# EasyEDA Pro project ProProject_2024智能车 驱动板_2024-10-06.epro

# Schematic Schematic1

## Sheets
1 Power: Create Date: 2024-02-26; Page Name: Power; Project Name: 2024智能车 驱动板; Schematic Name: Schematic1; Update Date: 2024-06-05; Company: 嘉立创EDA; Page Size: A4; Version: V1.0
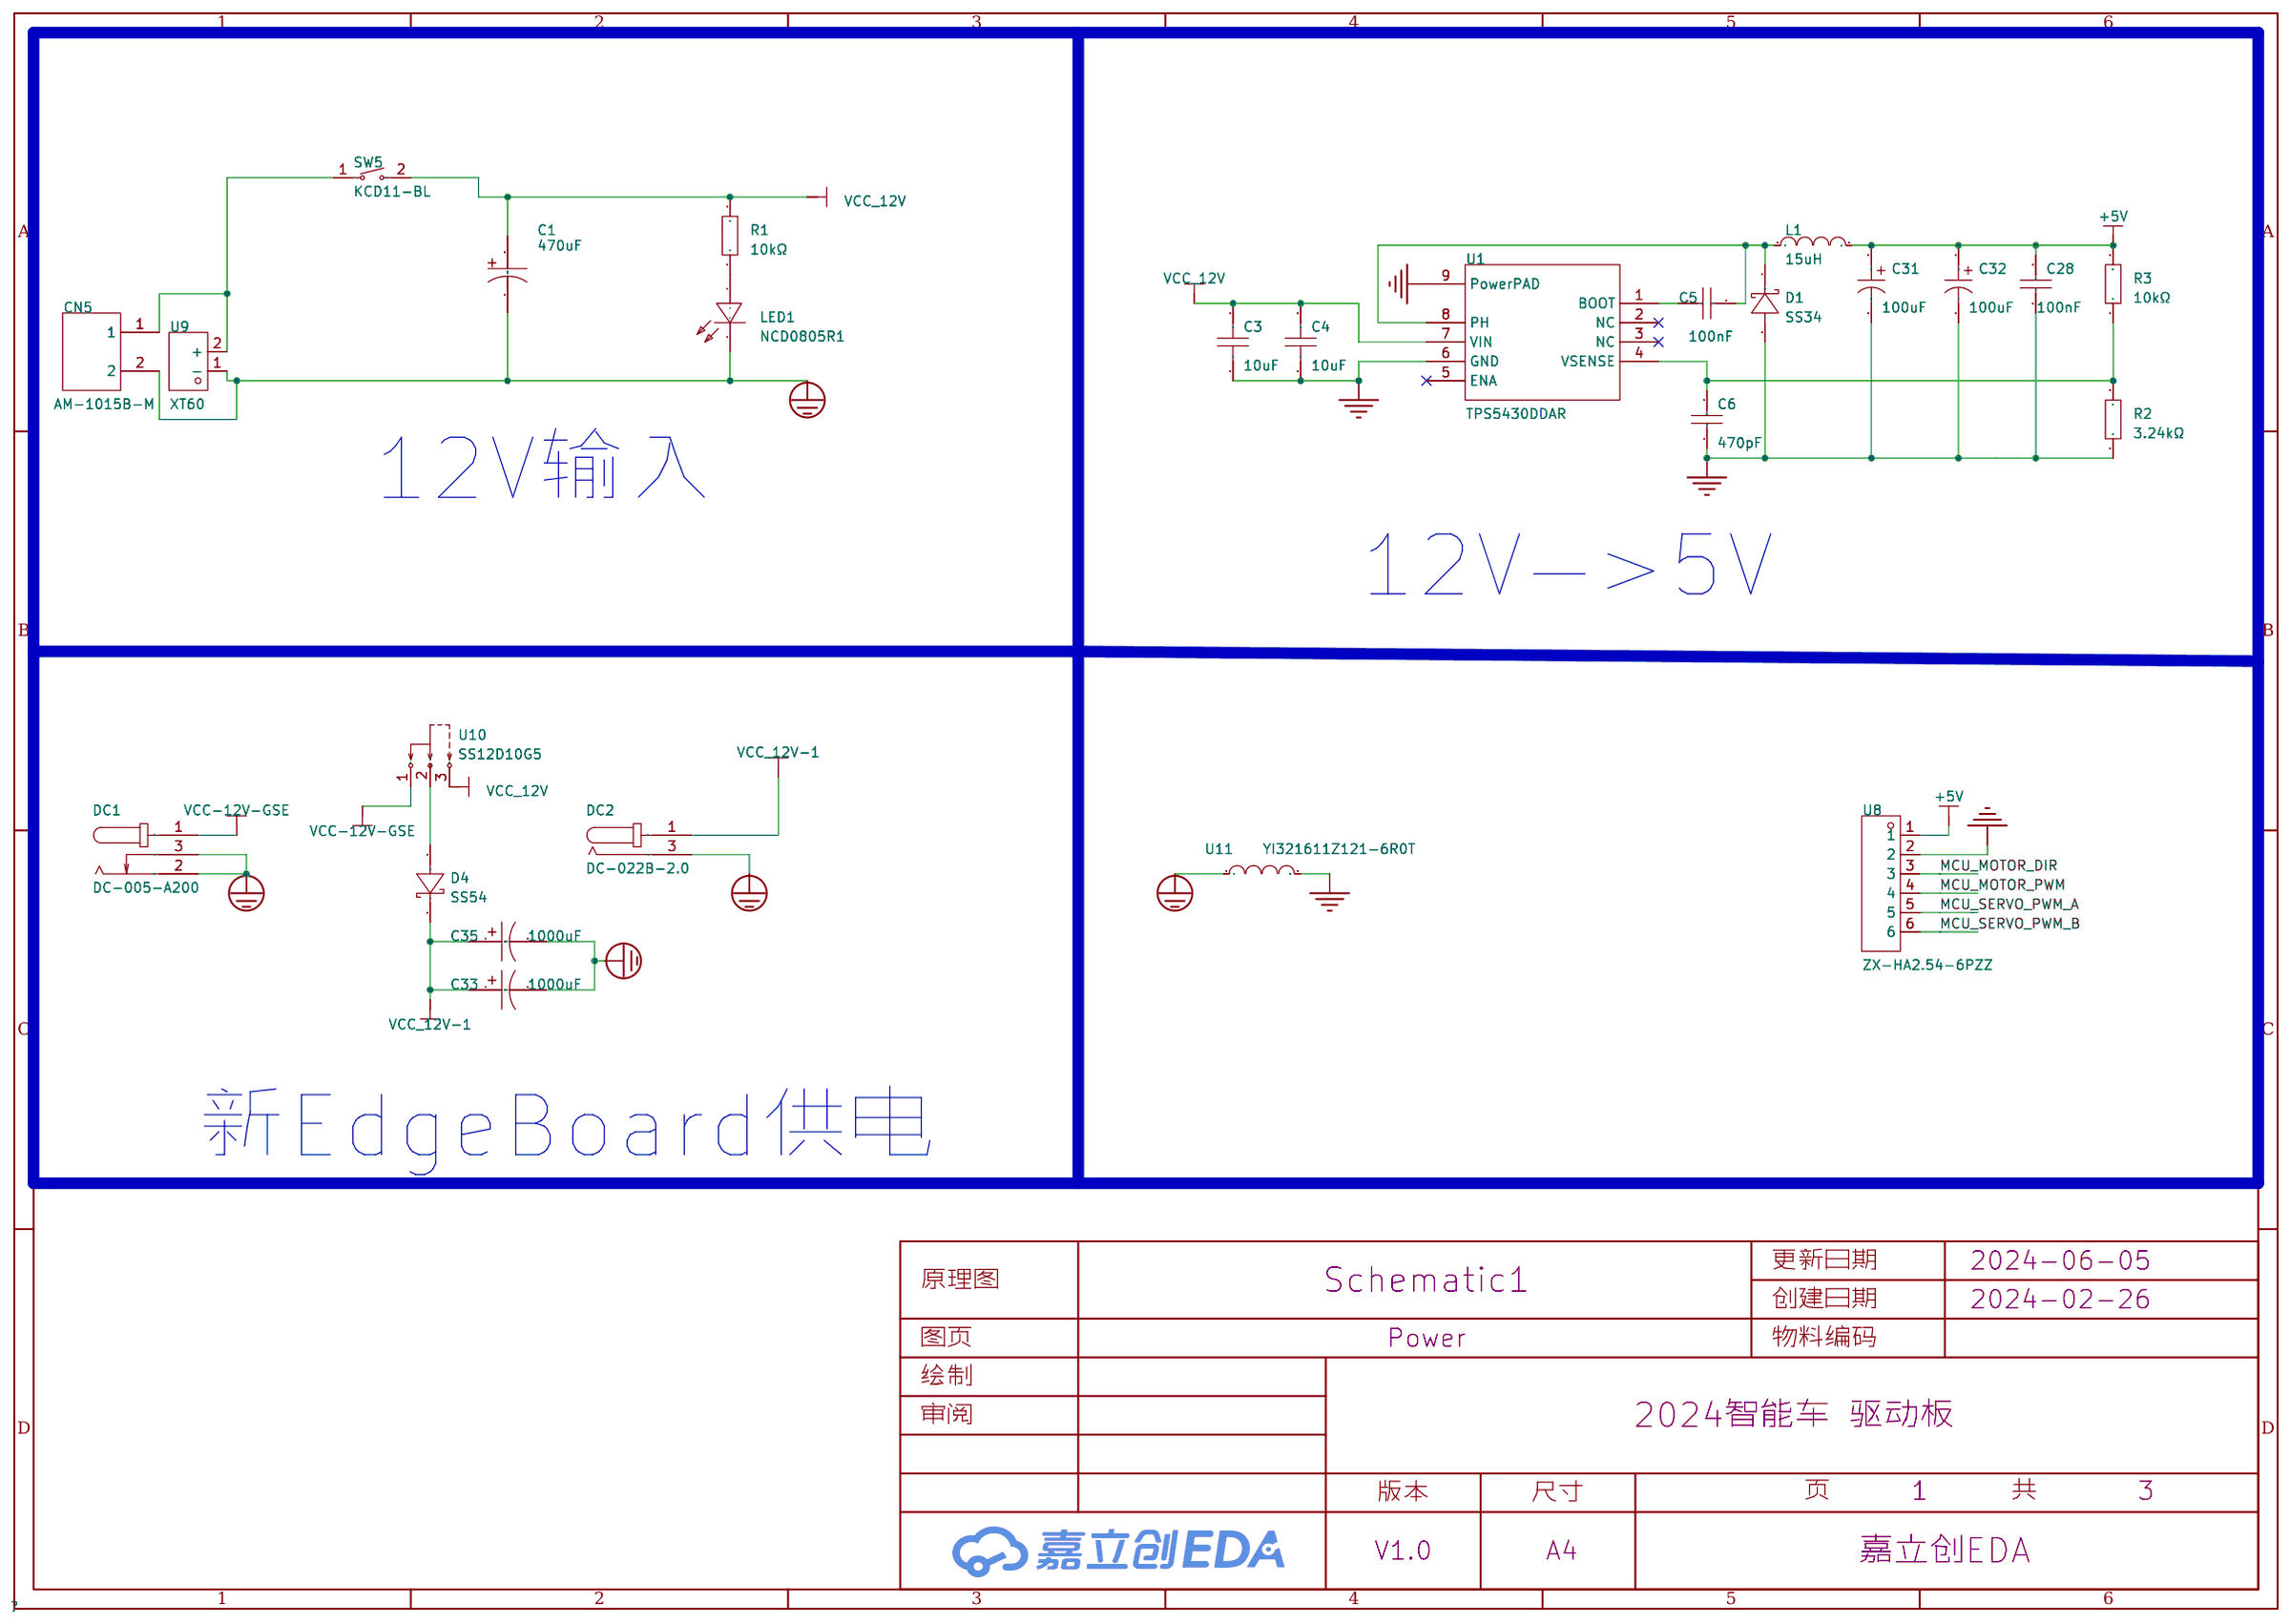
[diagram p0: Power]
2 Servo: Create Date: 2024-03-03; Page Name: Servo
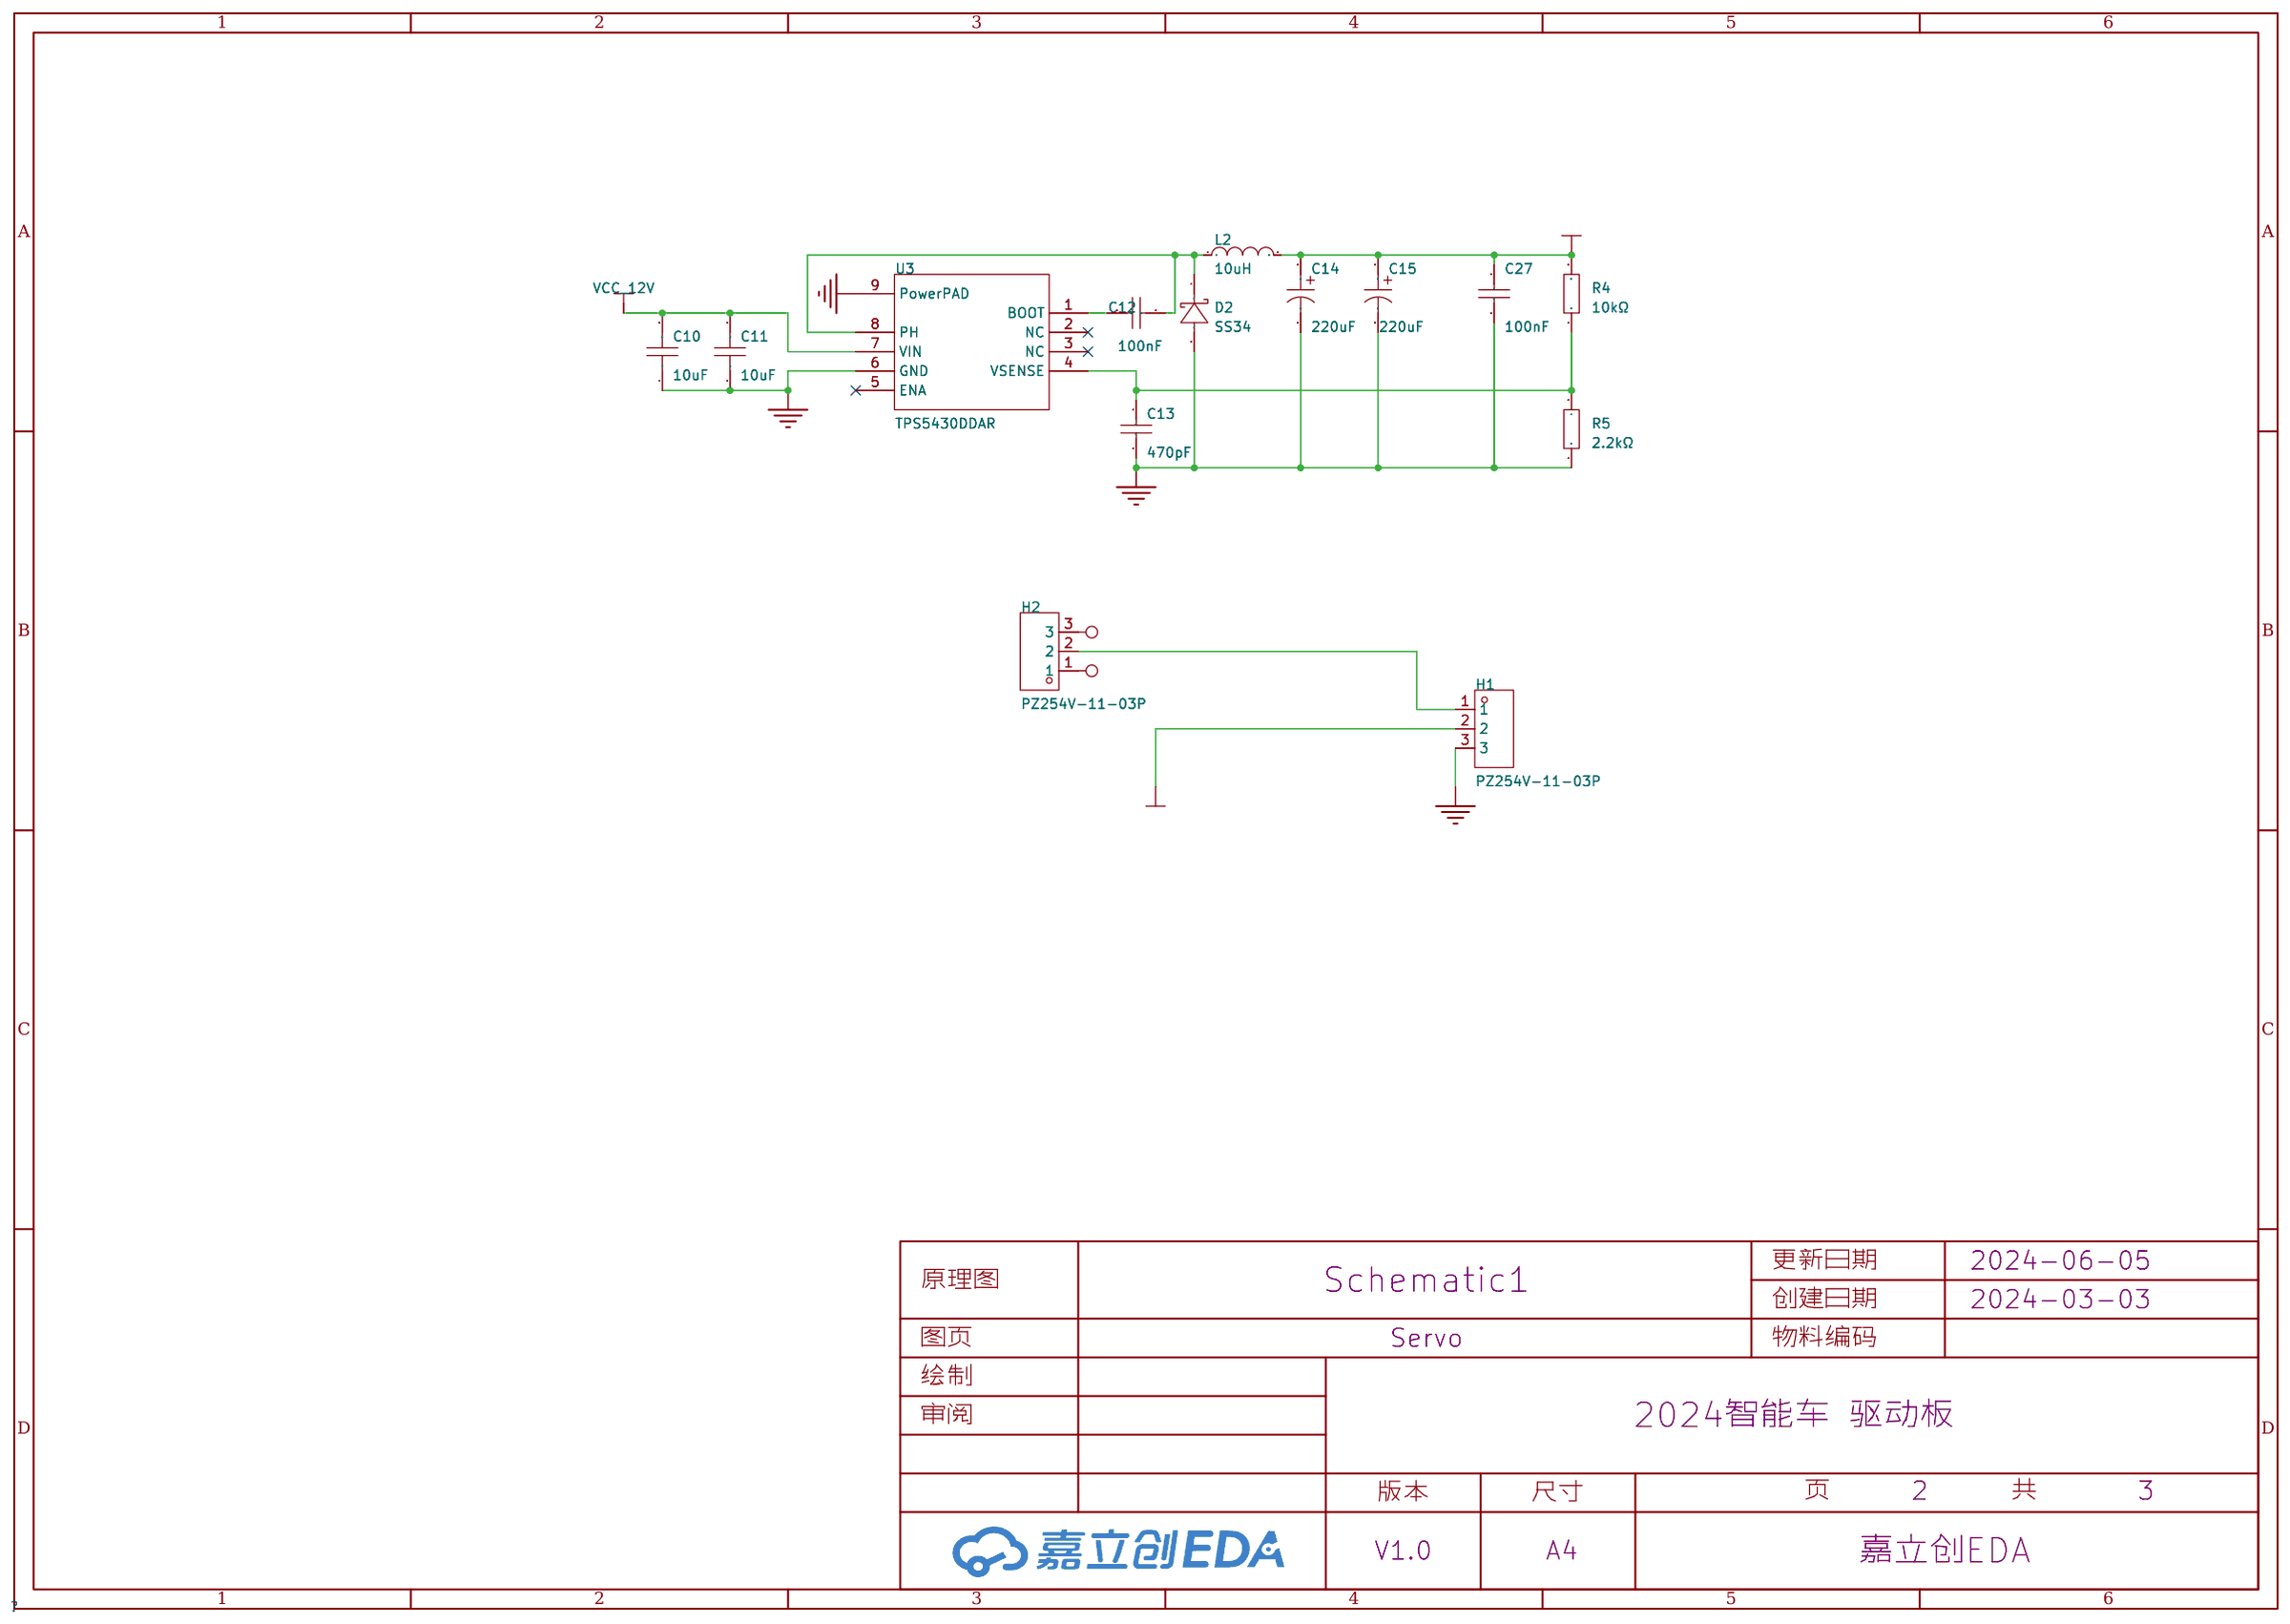
[diagram p1: Servo]
3 Motor DRV: Create Date: 2024-03-03; Page Name: Motor DRV
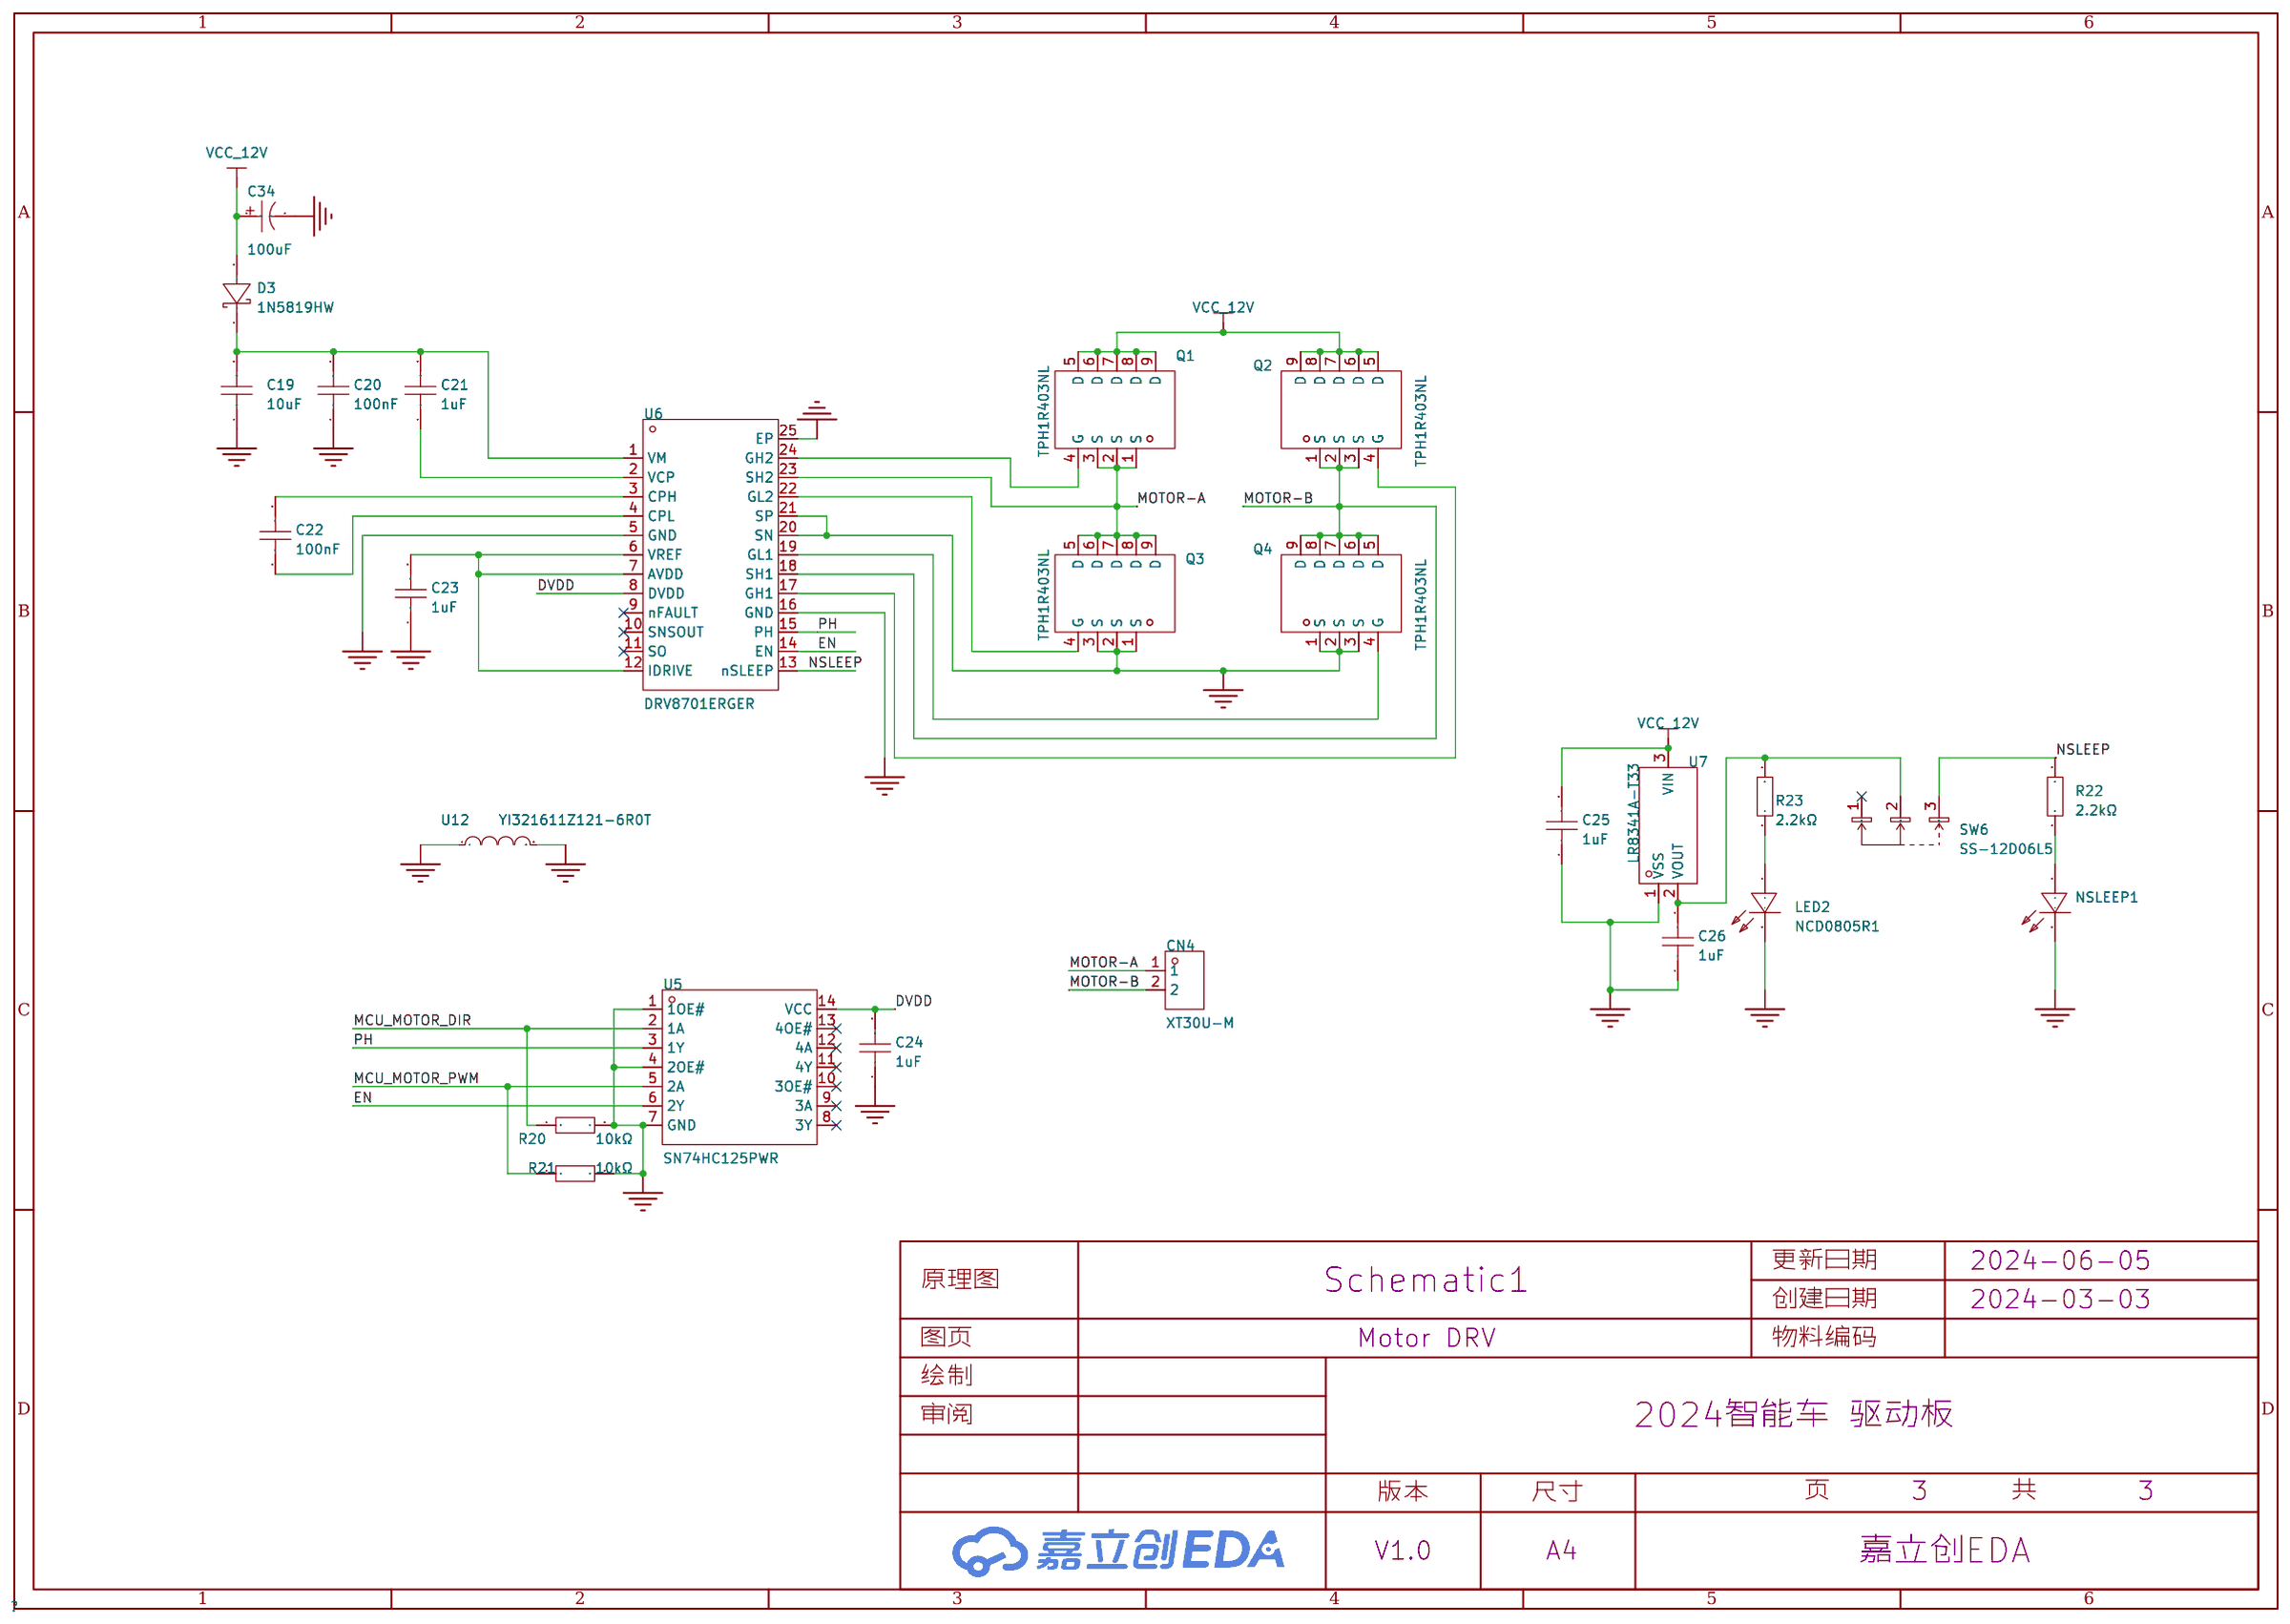
[diagram p2: Motor DRV]

## Parts
sheet Motor DRV
C19  10uF  [C0805]
C20  100nF  [C0603]
C21  1uF  [C0603]
C22  100nF  [C0603]
C23  1uF  [C0603]
C24  1uF  [C0603]
C25  1uF  [C0603]
C26  1uF  [C0603]
C34  100uF  [CAP-TH_BD6.3-P2.50-D1.0-FD]
CN4  XT30U-M  [CONN-TH_XT30U-M]
D3  1N5819HW  [SOD-123_L2.7-W1.6-LS3.7-RD-1]
LED2  NCD0805R1  [LED0805-R-RD]
NSLEEP1  NCD0805R1  [LED0805-R-RD]
Q1  TPH1R403NL  [DSOP-8_L5.0-W5.0-P1.27-LS6.0-BL-EP]
Q2  TPH1R403NL  [DSOP-8_L5.0-W5.0-P1.27-LS6.0-BL-EP]
Q3  TPH1R403NL  [DSOP-8_L5.0-W5.0-P1.27-LS6.0-BL-EP]
Q4  TPH1R403NL  [DSOP-8_L5.0-W5.0-P1.27-LS6.0-BL-EP]
R20  10kΩ  [R0603]
R21  10kΩ  [R0603]
R22  2.2kΩ  [R0603]
R23  2.2kΩ  [R0603]
SW6  SS-12D06L5  [SW-TH_3P-P4.70_L11.1-W12.7]
U5  SN74HC125PWR  [TSSOP-14_L5.0-W4.4-P0.65-LS6.5-BL]
U6  DRV8701ERGER  [VQFN-24_L4.0-W4.0-P0.50-BL-EP2.5]
U7  LR8341A-T33  [SOT-23-3L_L2.9-W1.6-P1.90-LS2.8-BL]
U12  YI321611Z121-6R0T  [L1206]
sheet Power
C1  470uF  [CAP-TH_BD8.0-P3.50-D0.6-FD]
C3  10uF  [C0805]
C4  10uF  [C0805]
C5  100nF  [C0603]
C6  470pF  [C0603]
C28  100nF  [C0603]
C31  100uF  [CAP-SMD_BD6.3-L6.6-W6.6-LS7.2-FD]
C32  100uF  [CAP-SMD_BD6.3-L6.6-W6.6-LS7.2-FD]
C33  1000uF  [CAP-TH_BD13.0-P5.00-D0.6-FD]
C35  1000uF  [CAP-TH_BD13.0-P5.00-D0.6-FD]
CN5  AM-1015B-M  [CONN-TH_AM-1015B-M]
D1  SS34  [SMA_L4.3-W2.5-LS5.0-RD]
D4  SS54  [SMA_L4.3-W2.6-LS5.0-RD]
DC1  DC-005-A200  [DC-IN-TH_DC-005-A200]
DC2  DC-022B-2.0  [DC-IN-TH_DC-022B-2.0]
L1  15uH  [IND-SMD_L7.0-W6.6_FXL0630]
LED1  NCD0805R1  [LED0805-R-RD]
R1  10kΩ  [R0805]
R2  3.24kΩ  [R0603]
R3  10kΩ  [R0603]
SW5  KCD11-BL  [SW-TH_KCD11-BL]
U1  TPS5430DDAR  [ESOP-8_L4.9-W3.9-P1.27-LS6.0-TL-EP]
U8  ZX-HA2.54-6PZZ  [CONN-TH_6P-P2.50_ZX-HA2.54-6PZZ]
U9  XT60  [CONN-TH_XT60]
U10  SS12D10G5  [SW-TH_SHOU-HAN_SS12D10G4]
U11  YI321611Z121-6R0T  [L1206]
sheet Servo
C10  10uF  [C0805]
C11  10uF  [C0805]
C12  100nF  [C0603]
C13  470pF  [C0603]
C14  220uF  [CAP-SMD_BD6.3-L6.6-W6.6-FD]
C15  220uF  [CAP-SMD_BD6.3-L6.6-W6.6-FD]
C27  100nF  [C0603]
D2  SS34  [SMA_L4.3-W2.5-LS5.0-RD]
H1  PZ254V-11-03P  [HDR-TH_3P-P2.54-V-M]
H2  PZ254V-11-03P  [HDR-TH_3P-P2.54-V-M]
L2  10uH  [IND-SMD_L7.0-W6.6_FXL0650]
R4  10kΩ  [R0603]
R5  2.2kΩ  [R0603]
U3  TPS5430DDAR  [ESOP-8_L4.9-W3.9-P1.27-LS6.0-TL-EP]

## Library data of the parts
C19 = GCM21BR7YA105KA55L: 容值:1uF;精度:±10%;额定电压:35V;材质(温度系数):X7R;; LCSC Part Name: 1uF ±10% 35V; Supplier Part: C161268; Manufacturer: muRata(村田); Supplier Footprint: 0805; JLCPCB Part Class: Extended Part; Datasheet: https://atta.szlcsc.com/upload/public/pdf/source/20180821/C161268_D058CC9A7C4743C3F9DA2C30E4C6C8F3.pdf; Supplier: LCSC; Tolerance: ±10%; Voltage Rated: 35V; Temperature Coefficient: X7R
C20 C22 = CC0603KRX7R9BB104: 容值:100nF;精度:±10%;额定电压:50V;材质(温度系数):X7R;; LCSC Part Name: 100nF ±10% 50V; Supplier Part: C14663; Manufacturer: YAGEO(国巨); Supplier Footprint: 0603; JLCPCB Part Class: Basic Part; Datasheet: https://atta.szlcsc.com/upload/public/pdf/source/20180910/C282072_33301C7F631E79921B82A8DAC6BCC5B3.pdf; Supplier: LCSC; Tolerance: ±10%; Voltage Rated: 50V; Temperature Coefficient: X7R
C21 C23 C25 C26 = CAP_0603: Supplier Footprint: 0603
C24 = CL10A105KB8NNNC: 容值:1uF;精度:±10%;额定电压:50V;材质(温度系数):X5R;; LCSC Part Name: 1uF ±10% 50V; Supplier Part: C15849; Manufacturer: SAMSUNG(三星); Supplier Footprint: 0603; JLCPCB Part Class: Basic Part; Datasheet: https://atta.szlcsc.com/upload/public/pdf/source/20160103/1457707679084.pdf; Supplier: LCSC; Tolerance: ±10%; Voltage Rated: 50V; Temperature Coefficient: X5R
C34 = 35ZLH100MEFC6.3X11: 容值:100uF;精度:±20%;额定电压:35V;纹波电流:270mA@120Hz;; LCSC Part Name: 100uF ±20% 35V; Supplier Part: C109392; Manufacturer: rubycon(红宝石); Supplier Footprint: 插件,D6.3xL11mm; JLCPCB Part Class: 扩展库; Datasheet: https://atta.szlcsc.com/upload/public/pdf/source/20180614/C225674_EFD3D7F922578D09CC26AE3D92425FB6.pdf; Supplier: LCSC; Tolerance: ±20%; Rated Voltage: 35V; Ripple Current: 270mA@120Hz; Lead Spacing: 2.5mm; φD: 6.3mm; L: 11mm; Lifetime @ Temp: 6000hrs@105℃; Operating Temperature: -40℃~+105℃
CN4 = XT30U-M: 类别:-;类型1:-;; LCSC Part Name: AMASS(艾迈斯)轻量版锂电池插头公头 XT30U-M; Supplier Part: C99101; Manufacturer: AMASS(艾迈斯); JLCPCB Part Class: 扩展库; Datasheet: https://atta.szlcsc.com/upload/public/pdf/source/20170606/1496716542582.pdf; Supplier: LCSC; Brand: 艾迈斯; Type: 插头; Colour: 黄色; InterfaceType: 公头
D3 = 1N5819HW: 二极管配置:-;直流反向耐压(Vr):40V;平均整流电流(Io):1A;正向压降(Vf):900mV@3A;反向电流(Ir):1mA@40V;; LCSC Part Name: 40V 1A 900mV@3A; Supplier Part: C2905649; Manufacturer: TECH PUBLIC(台舟); Supplier Footprint: SOD-123; JLCPCB Part Class: 扩展库; Datasheet: https://atta.szlcsc.com/upload/public/pdf/source/20211020/8C6B6169F42B21129AF0D528B0E96B00.pdf; Supplier: LCSC; Reverse Voltage (Vr): 40V; Average Rectified Current (Io): 1A; Forward Voltage (Vf@If): 900mV@3A; Reverse Leakage Current (Ir): 1mA@40V
LED1 LED2 = NCD0805R1: 灯头类型:-;发光颜色:红色;正向电压(VF):1.6V~2.6V;功率:65mW;正向电流:20mA;主波长:615nm~630nm;二极管配置:独立二极管;透镜颜色:无色透明透镜;色温:-;发光强度:67mcd~195mcd;发光角度:130°;载带方式:-;工作温度:-30℃~+85℃;; Supplier Part: C84256; Manufacturer: 国星光电; Supplier Footprint: 0805; JLCPCB Part Class: Basic Part; Datasheet: https://atta.szlcsc.com/upload/public/pdf/source/20200820/C84256_F0A75A43B3EAD75808600A0514C76B99.pdf; Supplier: LCSC; Emitted Color: 红色; Forward Voltage (VF): 1.6V~2.6V; Power Dissipation: 65mW; Forward Current: 20mA; Dominant Wavelength: 615nm~630nm; Diode Configuration: 独立二极管; Lens Color: 无色透明透镜; Luminous Intensity: 67mcd~195mcd; Viewing Angle: 130°; Operating Temperature: -30℃~+85℃
NSLEEP1 = NCD0805R1: 发光颜色:红灯;; LCSC Part Name: 红灯; Supplier Part: C84256; Manufacturer: 国星光电; Supplier Footprint: 0805; JLCPCB Part Class: 基础库; Datasheet: https://atta.szlcsc.com/upload/public/pdf/source/20200820/C84256_F0A75A43B3EAD75808600A0514C76B99.pdf; Supplier: LCSC; Emitted Color: 红灯; Forward Voltage (VF): 1.6V~2.6V; Power Dissipation: 65mW; Forward Current: 20mA; Dominant Wavelength: 615nm~630nm; Diode Configuration: 独立二极管; Lens Color: 无色透明透镜; Luminous Intensity: 67mcd~195mcd; Viewing Angle: 130°; Operating Temperature: -30℃~+85℃
Q1-Q4 = TPH1R403NL_C83440: 类型:N沟道;漏源电压(Vdss):30V;连续漏极电流(Id):150A;功率(Pd):64W;导通电阻(RDS(on)@Vgs,Id):1.4mΩ@10V,30A;阈值电压(Vgs(th)@Id):2.3V@500uA;; LCSC Part Name: N沟道 30V 150A; Supplier Part: C83440; Manufacturer: TOSHIBA(东芝); Supplier Footprint: DSOP-8-EP-5.0mm; JLCPCB Part Class: 扩展库; Datasheet: https://atta.szlcsc.com/upload/public/pdf/source/20170908/C83440_1504870121708958077.pdf; Supplier: LCSC; Type: N沟道; Drain Source Voltage (Vdss): 30V; Continuous Drain Current (Id): 150A; Power Dissipation (Pd): 64W; Drain Source On Resistance (RDS(on)@Vgs,Id): 1.4mΩ@10V,30A; Gate Threshold Voltage (Vgs(th)@Id): 2.3V@500uA
R20 R21 = 0603WAF1002T5E: 电阻类型:厚膜电阻;阻值:10kΩ;精度:±1%;功率:100mW;; LCSC Part Name: 厚膜电阻 10kΩ ±1% 100mW; Supplier Part: C25804; Manufacturer: UNI-ROYAL(厚声); Supplier Footprint: 0603; JLCPCB Part Class: Basic Part; Datasheet: https://atta.szlcsc.com/upload/public/pdf/source/20200306/C422600_1E6D84923E4A46A82E41ADD87F860B5C.pdf; Supplier: LCSC; Type: 厚膜电阻; Tolerance: ±1%; Power(Watts): 100mW; Overload Voltage (Max): 75V; Temperature Coefficient: ±100ppm/℃; Operating Temperature Range: -55℃~+155℃
R5 R22 R23 = 0603WAF2201T5E: 电阻类型:厚膜电阻;阻值:2.2kΩ;精度:±1%;功率:100mW;; LCSC Part Name: 2.2kΩ ±1% 100mW; Supplier Part: C4190; Manufacturer: UNI-ROYAL(厚声); Supplier Footprint: 0603; JLCPCB Part Class: Basic Part; Datasheet: https://atta.szlcsc.com/upload/public/pdf/source/20200306/C422600_1E6D84923E4A46A82E41ADD87F860B5C.pdf; Supplier: LCSC; Type: 厚膜电阻; Tolerance: ±1%; Power(Watts): 100mW; Temperature Coefficient: ±100ppm/℃; Overload Voltage (Max): 75V; Operating Temperature Range: -55℃~+155℃
SW6 = SS-12D06L5: 电路结构:单刀双掷;安装方式:侧插;开关颜色:黑色;额定电流(DC):3A;额定电压(DC):250V;额定电流(AC):3A;额定电压(AC):250V;机械寿命:1万次;; LCSC Part Name: 柄长5mm 卧插双档 滑动开关; Supplier Part: C319015; Manufacturer: XKB Connectivity(中国星坤); Supplier Footprint: 插件; JLCPCB Part Class: 扩展库; Datasheet: https://atta.szlcsc.com/upload/public/pdf/source/20211009/0D67854FD60FB1F6FE75130AD47C052C.pdf; Supplier: LCSC; Circuit: 单刀双掷; Actuator Style: 矩形柱状; Pin Style: PC引脚; Switch Length: 12.95mm; Switch Width: 6.6mm; Switch Height: 6.3mm; Mounting Style: 侧插; Actuator Color: 黑色; Current Rating (DC): 3A; Voltage Rating (DC): 250V; Current Rating (AC): 3A; Voltage Rating (AC): 250V; Mechanical Life: 1万次; Operating Temperature: -40℃~+85℃
U5 = SN74HC125PWR: 类型:缓冲器，非反相;电源电压:2V~6V;输入类型:-;输出类型:三态;低电平输出电流(IOL):7.8mA;高电平输出电流(IOH):7.8mA;工作温度:-40℃~+85℃;; Supplier Part: C132994; Manufacturer: TI(德州仪器); Supplier Footprint: TSSOP-14; JLCPCB Part Class: 扩展库; Datasheet: https://atta.szlcsc.com/upload/public/pdf/source/20170930/C132994_1506736365150997346.pdf; Supplier: LCSC; Type: 缓冲器，非反相; Supply Voltage: 2V~6V; output type: 三态; Current-OutputLow: 7.8mA; Current-OutputHigh: 7.8mA; Operating temperature: -40℃~+85℃
U6 = DRV8701ERGER: 类型:有刷直流电机;电源电压:5.9V~45V;输出电流:-;接口:并行;; LCSC Part Name: 有刷直流电机驱动芯片 45V; Supplier Part: C90964; Manufacturer: TI(德州仪器); Supplier Footprint: VQFN-24-EP(4x4); JLCPCB Part Class: 扩展库; Datasheet: https://atta.szlcsc.com/upload/public/pdf/source/20190902/C90964_2DCC43C1A4AE58E3ED96296E8C78517C.pdf; Supplier: LCSC; Type: 有刷直流电机; Supply Voltage: 5.9V~45V; Interface: 并行; Operating Temperature: -40℃~+125℃@(Ta)
U7 = LR8341A-T33: 输出类型:固定;输出极性:正;最大输入电压:40V;输出电压:3.3V;输出电流:100mA;电源纹波抑制比(PSRR):55dB@(1kHz);; LCSC Part Name: 输入40V 输出3.3V 100mA; Supplier Part: C2829465; Manufacturer: LR(朗瑞); Supplier Footprint: SOT-23-3L; JLCPCB Part Class: 扩展库; Datasheet: https://atta.szlcsc.com/upload/public/pdf/source/20210426/C2829465_61F15D7ACE9671B48D4F69A8092B0D8F.pdf; Supplier: LCSC; Output Type: 固定; Output Polarity: 正; Number of Outputs: 1; Maximum Input Voltage: 40V; Output Voltage: 3.3V; Quiescent Current (Ground Current): 2uA; Output Current: 100mA; Power Supply Rejection Ratio (PSRR): 55dB@(1kHz); Operating Temperature: -40℃~+85℃
U11 U12 = YI321611Z121-6R0T: 标称阻抗@测试频率:120Ω@100MHz;误差:±25%;直流电阻(RDC):20mΩ;; LCSC Part Name: 单路 1206磁珠 阻抗120Ω@100MHz; Supplier Part: C3011219; Manufacturer: YJYCOIN(益嘉源); Supplier Footprint: 1206; JLCPCB Part Class: 扩展库; Datasheet: https://atta.szlcsc.com/upload/public/pdf/source/20220509/3E48631472F3D6A01C6E16446780DC14.pdf; Supplier: LCSC; Impedance @ Frequency: 120Ω@100MHz; Tolerance: ±25%; DC Resistance: 20mΩ; Current Rating: 6A; Circuits: 1
C1 = 01EC1227SHC470UF25V: 容值:470uF;精度:±20%;额定电压:25V;纹波电流:250mA@100kHz;等效串联电阻:-;; LCSC Part Name: 470uF ±20% 25V; Supplier Part: C503221; Manufacturer: KNSCHA(科尼盛); Supplier Footprint: 插件,D8xL12mm; JLCPCB Part Class: 扩展库; Datasheet: https://atta.szlcsc.com/upload/public/pdf/source/20200324/C503221_3FC66269E734A166B471EC680D845F86.pdf; Supplier: LCSC; Tolerance: ±20%; Rated Voltage: 25V; Ripple Current: 250mA@100kHz; Lead Spacing: 3.5mm; φD: 8mm; L: 12mm; Lifetime @ Temp: 2000hrs@105℃
C3 C4 C10 C11 = CL21A106KAYNNNE_C15850: 容值:10uF;精度:±10%;额定电压:25V;材质(温度系数):X5R;; LCSC Part Name: 10uF ±10% 25V; Supplier Part: C15850; Manufacturer: SAMSUNG(三星); Manufacturer Part: CL21A106KAYNNNE; Supplier Footprint: 0805; JLCPCB Part Class: 基础库; Datasheet: https://atta.szlcsc.com/upload/public/pdf/source/20160218/1457707763339.pdf; Supplier: LCSC; Tolerance: ±10%; Voltage Rated: 25V; Temperature Coefficient: X5R
C5 C12 C27 C28 = 0603B104K500NT: 容值:100nF;精度:±10%;额定电压:50V;材质(温度系数):X7R;; LCSC Part Name: 100nF ±10% 50V; Supplier Part: C30926; Manufacturer: FH(风华); Supplier Footprint: 0603; JLCPCB Part Class: 扩展库; Datasheet: https://atta.szlcsc.com/upload/public/pdf/source/20200305/C486355_26A10D38EF8C2A5C37091D0039909270.pdf; Supplier: LCSC; Tolerance: ±10%; Voltage Rated: 50V; Temperature Coefficient: X7R
C6 C13 = 0603B471K500NT: 容值:470pF;精度:±10%;额定电压:50V;材质(温度系数):X7R;; LCSC Part Name: 470pF ±10% 50V; Supplier Part: C1620; Manufacturer: FH(风华); Supplier Footprint: 0603; JLCPCB Part Class: Basic Part; Datasheet: https://atta.szlcsc.com/upload/public/pdf/source/20200305/C486355_26A10D38EF8C2A5C37091D0039909270.pdf; Supplier: LCSC; Tolerance: ±10%; Voltage Rated: 50V; Temperature Coefficient: X7R
C31 C32 = RVT100UF16V67RV0016: 容值:100uF;精度:±20%;额定电压:16V;纹波电流:93mA@120Hz;等效串联电阻:-;; LCSC Part Name: 100uF ±20% 16V; Supplier Part: C2887276; Manufacturer: KNSCHA(科尼盛); Supplier Footprint: SMD,D6.3xL5.4mm; JLCPCB Part Class: 扩展库; Datasheet: https://atta.szlcsc.com/upload/public/pdf/source/20210824/B97D2C1FD85DB1F31706138D89C4BE44.pdf; Supplier: LCSC; Tolerance: ±20%; Rated Voltage: 16V; Ripple Current: 93mA@120Hz; φD: 6.3mm; L: 5.4mm; Lifetime @ Temp: 2000hrs@105℃; Operating Temperature: -55℃~+105℃
C33 C35 = SHF1000UF35V01EC4584: 容值:1000uF;精度:±20%;额定电压:35V;纹波电流:-;等效串联电阻:-;; LCSC Part Name: 1000uF ±20% 35V; Supplier Part: C2992582; Manufacturer: KNSCHA(科尼盛); Supplier Footprint: 插件,D13xL20mm; JLCPCB Part Class: 扩展库; Datasheet: https://atta.szlcsc.com/upload/public/pdf/source/20220414/EE5BC95532272EB5E0CB3647C59C3CA5.pdf; Supplier: LCSC; Tolerance: ±20%; Rated Voltage: 35V
CN5 = AM-1015B-M: 类别:-;类型1:-;; LCSC Part Name: AMASS(艾迈斯)电源连接器公头AM-1015B-M; Supplier Part: C90631; Manufacturer: AMASS(艾迈斯); JLCPCB Part Class: Extended Part; Datasheet: https://atta.szlcsc.com/upload/public/pdf/source/20161217/1481939174683.pdf; Supplier: LCSC; Brand: 艾迈斯; Type: T行插头; RatedVoltage: DC 500V; InterfaceType: 双公头; MetalMaterial: 铜镀金; InsulationMaterial: PA; RatedCurrent: 25A; RecommendedWireGauge: 12AWG; FlameRetardantGrade: UL94 V0; contact resistance: 0.45mΩ
D1 D2 = SS34_C727060: 二极管配置:独立式;正向压降(Vf):550mV@3A;直流反向耐压(Vr):40V;平均整流电流(Io):3A;; LCSC Part Name: 电压:40V 电流:3A; Supplier Part: C727060; Manufacturer: TWGMC(台湾迪嘉); Supplier Footprint: SMA(DO-214AC); JLCPCB Part Class: 扩展库; Datasheet: https://atta.szlcsc.com/upload/public/pdf/source/20200828/C727059_6599B6CAC5F3238B9C33E46794659DBE.pdf; Supplier: LCSC; Diode Configuration: 独立式; Forward Voltage (Vf@If): 550mV@3A; Reverse Voltage (Vr): 40V; Average Rectified Current (Io): 3A; Reverse Leakage Current (Ir): 500uA@40V
D4 = SS54_C727065: 二极管配置:独立式;正向压降(Vf):550mV@5A;直流反向耐压(Vr):40V;平均整流电流(Io):5A;; LCSC Part Name: 电压:40V 电流:5A; Supplier Part: C727065; Manufacturer: TWGMC(台湾迪嘉); Supplier Footprint: SMA(DO-214AC); JLCPCB Part Class: 扩展库; Datasheet: https://atta.szlcsc.com/upload/public/pdf/source/20200828/C727064_BD0A2B36CBC76CEA4B6710C57718D41F.pdf; Supplier: LCSC; Diode Configuration: 独立式; Forward Voltage (Vf@If): 550mV@5A; Reverse Voltage (Vr): 40V; Average Rectified Current (Io): 5A; Reverse Leakage Current (Ir): 500uA@40V
DC1 = DC-005-A200: 连接器类型:DC电源插座;安装方式:弯插;触点内径:2mm;触点外径:6.4mm;额定电流:3A;额定电压:30V;工作温度范围:-20℃~+70℃;; LCSC Part Name: DC电源插座 内径:2mm 外径:6.4mm; Supplier Part: C720557; Manufacturer: XUNPU(讯普); Supplier Footprint: 插件; JLCPCB Part Class: 扩展库; Datasheet: https://atta.szlcsc.com/upload/public/pdf/source/20200812/C720557_2286DFCD6C75B71AF905731F627ABF3A.pdf; Supplier: LCSC; Connector Type: DC电源插座; Mounting Style: 弯插; Inside Contact Diameter: 2mm; Outside Contact Diameter: 6.4mm; Current Rating (Max): 3A; Voltage Rating (Max): 30V; Operating Temperature Range: -20℃~+70℃
DC2 = DC-022B-2.0: 连接器类型:DC电源插座;安装方式:面板安装;触点内径:2mm;触点外径:6.6mm;额定电流:2A;额定电压:30V;触头材质:黄铜;工作温度范围:-20℃~+70℃;焊接温度(最大值):260℃;; LCSC Part Name: DC电源插座 内径:2mm 外径:6.6mm (2件套，附螺母一枚); Supplier Part: C319097; Manufacturer: XKB Connectivity(中国星坤); Supplier Footprint: 插件; JLCPCB Part Class: 扩展库; Datasheet: https://atta.szlcsc.com/upload/public/pdf/source/20200227/C319097_B6DCE5C2FA572974C8DEC7932CCBB8CB.pdf; Supplier: LCSC; Connector Type: DC电源插座; Mounting Style: 面板安装; Inside Contact Diameter: 2mm; Outside Contact Diameter: 6.6mm; Current Rating (Max): 2A; Voltage Rating (Max): 30V; Contact Material: 黄铜; Operating Temperature Range: -20℃~+70℃; Soldering Temperature(Max): 260℃
L1 = FXL0630-150-M: 电感值:15uH;精度:±20%;额定电流:3A;饱和电流(Isat):4.5A;类型:一体成型电感;; LCSC Part Name: 15uH ±20% 4.5A; Supplier Part: C177243; Manufacturer: cjiang(长江微电); Supplier Footprint: SMD,6.6x7mm; JLCPCB Part Class: 扩展库; Datasheet: https://atta.szlcsc.com/upload/public/pdf/source/20230516/3A080F5AF8C87BB81C3BA86E5F60E51A.pdf; Supplier: LCSC; Tolerance: ±20%; Rated Current: 3A; Saturation Current (Isat): 4.5A; DC Resistance (DCR): 115mΩ; Type: 一体成型电感
R1 = 0805W8F1002T5E_C17414: 电阻类型:厚膜电阻;阻值:10kΩ;精度:±1%;功率:125mW;最大工作电压:150V;温度系数:±100ppm/℃;; LCSC Part Name: 10kΩ ±1% 125mW 厚膜电阻; Supplier Part: C17414; Manufacturer: UNI-ROYAL(厚声); Manufacturer Part: 0805W8F1002T5E; Supplier Footprint: 0805; JLCPCB Part Class: 基础库; Datasheet: https://atta.szlcsc.com/upload/public/pdf/source/20200306/C422600_1E6D84923E4A46A82E41ADD87F860B5C.pdf; Supplier: LCSC; Type: 厚膜电阻; Tolerance: ±1%; Power(Watts): 125mW; Overload Voltage (Max): 150V; Temperature Coefficient: ±100ppm/℃; Operating Temperature Range: -55℃~+155℃
R2 = 0603WAF3241T5E: 电阻类型:厚膜电阻;阻值:3.24kΩ;精度:±1%;功率:100mW;最大工作电压:75V;温度系数:±100ppm/℃;; LCSC Part Name: 3.24kΩ ±1% 100mW 厚膜电阻; Supplier Part: C22994; Manufacturer: UNI-ROYAL(厚声); Supplier Footprint: 0603; JLCPCB Part Class: 扩展库; Datasheet: https://atta.szlcsc.com/upload/public/pdf/source/20200306/C422600_1E6D84923E4A46A82E41ADD87F860B5C.pdf; Supplier: LCSC; Type: 厚膜电阻; Tolerance: ±1%; Power(Watts): 100mW; Overload Voltage (Max): 75V; Temperature Coefficient: ±100ppm/℃; Operating Temperature Range: -55℃~+155℃
R3 R4 = 0603WAF1002T5E: 电阻类型:厚膜电阻;阻值:10kΩ;精度:±1%;功率:100mW;最大工作电压:75V;温度系数:±100ppm/℃;; LCSC Part Name: 厚膜电阻 10kΩ ±1% 100mW; Supplier Part: C25804; Manufacturer: UNI-ROYAL(厚声); Supplier Footprint: 0603; JLCPCB Part Class: 基础库; Datasheet: https://atta.szlcsc.com/upload/public/pdf/source/20200306/C422600_1E6D84923E4A46A82E41ADD87F860B5C.pdf; Supplier: LCSC; Type: 厚膜电阻; Tolerance: ±1%; Power(Watts): 100mW; Overload Voltage (Max): 75V; Temperature Coefficient: ±100ppm/℃; Operating Temperature Range: -55℃~+155℃
SW5 = KCD11-BL: 带灯:无;引脚样式:焊片;额定电流:3A;额定电压(AC):250V;额定电压(DC):-;电路结构:单刀单掷;机械寿命:1万次;; LCSC Part Name: 8.5*13.5mm 两脚两档跷板开关 弯脚黑色; Supplier Part: C5884425; Manufacturer: SHOU HAN(首韩); Supplier Footprint: 插件; JLCPCB Part Class: 扩展库; Datasheet: https://atta.szlcsc.com/upload/public/pdf/source/20230506/D19723151650CF5F30045C42EB7F85BE.pdf; Supplier: LCSC; Switch Length: 13.5mm; Switch Width: 8.5mm; Switch Height: 19.5mm; Actuator Type: 凹面弯曲; With Lamp: 无; Pin Style: 焊片; Actuator Color: 黑色; Contact Current: 3A; Voltage Rating (AC): 250V; Circuit: 单刀单掷; Mechanical Life: 1万次; Operating Temperature: 0℃~+125℃; Actuator Identifier: - O
U1 U3 = TPS5430DDAR: 功能类型:降压型;输出类型:可调;输入电压:5.5V~36V;输出电压:1.221V~32.04V;输出电流(最大值):3A;; LCSC Part Name: 降压 3A 36V; Supplier Part: C9864; Manufacturer: TI(德州仪器); Supplier Footprint: SOIC-8-EP; JLCPCB Part Class: 基础库; Datasheet: https://www.ti.com/cn/lit/gpn/tps5430; Supplier: LCSC; Function: 降压型; Output Type: 可调; Input Voltage: 5.5V~36V; Output Voltage: 1.221V~32.04V; Output Current (Max): 3A; Switching Frequency: 500kHz; Operating Temperature: -40℃~+125℃@(TJ); Synchronous Rectification: 否; Number of Outputs: 1; Topology: 降压式; Switch tube (built-in/external): 内置
U8 = ZX-HA2.54-6PZZ: 插针结构:1x6P;间距:2.54mm;安装方式:直插;参考系列:XH;总PIN数:6P;排数:1;每排PIN数:6;行距:-;额定电流:3A;触头材质:黄铜;触头镀层:锡;工作温度范围:-25℃~+85℃;; LCSC Part Name: 1x6P 间距:2.54mm 直插 系列:XH/HA带扣; Supplier Part: C7429618; Manufacturer: Megastar(兆星); Supplier Footprint: 插件,P=2.54mm; JLCPCB Part Class: 扩展库; Datasheet: https://atta.szlcsc.com/upload/public/pdf/source/20230619/9741958357BE16A00186B372434A49B2.pdf; Supplier: LCSC; Pins Structure: 1x6P; Pitch: 2.54mm; Mounting Style: 直插; Reference Series: XH; Number of Pins: 6P; Number of Rows: 1; Number of PINs Per Row: 6; Current Rating (Max): 3A; Contact Material: 黄铜; Contact Plating: 锡; Operating Temperature Range: -25℃~+85℃
U9 = XT60: 类别:-;类型1:-;; LCSC Part Name: AMASS(艾迈斯) XT60模型插头 3.5mm镀金香蕉头公头（电调端）XT60-M; Supplier Part: C98733; Manufacturer: AMASS(艾迈斯); JLCPCB Part Class: 扩展库; Datasheet: https://atta.szlcsc.com/upload/public/pdf/source/20170606/1496716524919.pdf; Supplier: LCSC; Brand: 艾迈斯; Type: 香蕉头; Colour: 黄色; InterfaceType: 公头; specifications: 3.5mm
U10 = SS12D10G5: 电路结构:单刀双掷;安装方式:直插;额定电流(DC):2A;额定电压(DC):125V;机械寿命:3千次;; LCSC Part Name: 两档立式插件 3脚拨动开关 柄长5.0mm; Supplier Part: C7431054; Manufacturer: SHOU HAN(首韩); Supplier Footprint: 插件; JLCPCB Part Class: 扩展库; Datasheet: https://atta.szlcsc.com/upload/public/pdf/source/20231130/7A3DB6A149BF0A1DCFFE64FFC07FE434.pdf; Supplier: LCSC; Circuit: 单刀双掷; Switch Length: 12.7mm; Switch Width: 6.7mm; Mounting Style: 直插; Current Rating (DC): 2A; Voltage Rating (DC): 125V; Mechanical Life: 3千次; Operating Temperature: -25℃~+70℃
C14 C15 = RVT220UF16V67RV0015: 容值:220uF;精度:±20%;额定电压:16V;纹波电流:110mA@120Hz;等效串联电阻:-;; LCSC Part Name: 220uF ±20% 16V; Supplier Part: C2887273; Manufacturer: KNSCHA(科尼盛); Supplier Footprint: SMD,D6.3xL7.7mm; JLCPCB Part Class: 扩展库; Datasheet: https://atta.szlcsc.com/upload/public/pdf/source/20210824/3DC9999D9B098FE241E3A26137981C4C.pdf; Supplier: LCSC; Tolerance: ±20%; Rated Voltage: 16V; Ripple Current: 110mA@120Hz; φD: 6.3mm; L: 7.7mm; Lifetime @ Temp: 2000hrs@105℃; Operating Temperature: -55℃~+105℃
H1 H2 = PZ254V-11-03P: 插针结构:1x3P;间距:2.54mm;行距:-;圆针/方针:方针;安装类型:直插;排数:单排;总PIN位数:3P;额定电流:3A;额定电压:250V;配合针长度:6mm;塑高:2.5mm;端接针长度:3mm;工作温度范围:-40℃~+105℃;颜色:黑色;; LCSC Part Name: 间距:2.54mm 1x3P 直插 方针; Supplier Part: C2937625; Manufacturer: XFCN(兴飞); Supplier Footprint: 插件,P=2.54mm; JLCPCB Part Class: Extended Part; Datasheet: https://atta.szlcsc.com/upload/public/pdf/source/20200309/C492402_8335C3D49C4E4C618838D59BB1D024C1.pdf; Supplier: LCSC; Pin Structure: 1x3P; Pitch: 2.54mm; Circluar Pins/Square Pins: 方针; Mounting Type: 直插; Number of Rows: 单排; Number of Pins: 3P; Current Rating (Max): 3A; Voltage Rating (Max): 250V; Length of Mating Pin: 6mm; Insulation Height: 2.5mm; Length of End Connection Pin: 3mm; Operating Temperature Range: -40℃~+105℃; Color: 黑色
L2 = FXL0650-100-M: 电感值:10uH;精度:±20%;额定电流:4.5A;饱和电流(Isat):5.3A;类型:一体成型电感;; LCSC Part Name: 10uH ±20% 5.3A; Supplier Part: C475521; Manufacturer: cjiang(长江微电); Supplier Footprint: SMD,6.6x7mm; JLCPCB Part Class: 扩展库; Datasheet: https://atta.szlcsc.com/upload/public/pdf/source/20230516/677FF0B270D5BF5CC59B858CE23820C0.pdf; Supplier: LCSC; Tolerance: ±20%; Rated Current: 4.5A; Saturation Current (Isat): 5.3A; DC Resistance (DCR): 60mΩ; Type: 一体成型电感

## Nets
+5V: C28.1 C31.1 C32.1 L1.2 R3.2 U8.1
DVDD: C24.2 U5.14(VCC) U6.8(DVDD)
GND: C3.1 C4.1 C6.1 C10.1 C11.1 C13.1 C14.2 C15.2 C27.2 C28.2 C31.2 C32.2 D1.2(A) D2.2(A) H1.3 R2.1 R5.1 U1.6(GND) U1.9(PowerPAD) U3.6(GND) U3.9(PowerPAD) U8.2 U11.2 U12.1
GND_DRV: C19.1 C20.1 C23.1 C24.1 C25.1 C26.1 C34.2 LED2.2(-) NSLEEP1.2(-) Q3.1(S) Q3.2(S) Q3.3(S) Q4.1(S) Q4.2(S) Q4.3(S) R20.2 R21.2 U5.1(1OE#) U5.4(2OE#) U5.7(GND) U6.5(GND) U6.16(GND) U6.20(SN) U6.21(SP) U6.25(EP) U7.1(VSS) U12.2
PGND: C1.2 C33.2 C35.2 CN5.2 DC1.2 DC1.3 DC2.3 LED1.2(-) U9.1(-) U11.1
VCC-12V-GSE: DC1.1 U10.1
VCC_12V: C1.1 C3.2 C4.2 C10.2 C11.2 C25.2 C34.1 D3.2(A) Q1.5(D) Q1.6(D) Q1.7(D) Q1.8(D) Q1.9(D) Q2.5(D) Q2.6(D) Q2.7(D) Q2.8(D) Q2.9(D) R1.2 SW5.2 U1.7(VIN) U3.7(VIN) U7.3(VIN) U10.3
VCC_12V-1: C33.1 C35.1 D4.1 DC2.1
EN: U5.6(2Y) U6.14(EN)
MCU_MOTOR_DIR: R20.1 U5.2(1A) U8.3
MCU_MOTOR_PWM: R21.1 U5.5(2A) U8.4
MCU_SERVO_PWM_A: H2.1 U8.5
MCU_SERVO_PWM_B: H2.3 U8.6
MOTOR-A: CN4.1 Q1.1(S) Q1.2(S) Q1.3(S) Q3.5(D) Q3.6(D) Q3.7(D) Q3.8(D) Q3.9(D) U6.23(SH2)
MOTOR-B: CN4.2 Q2.1(S) Q2.2(S) Q2.3(S) Q4.5(D) Q4.6(D) Q4.7(D) Q4.8(D) Q4.9(D) U6.18(SH1)
NSLEEP: R22.2 SW6.3 U6.13(nSLEEP)
PH: U5.3(1Y) U6.15(PH)
SERVO_6V35: C14.1 C15.1 C27.1 H1.2 L2.2 R4.2
$1N587: LED1.1(+) R1.1
$1N979: C5.2 U1.1(BOOT)
$1N1371: C5.1 D1.1(C) L1.1 U1.8(PH)
$1N1705: C6.2 R2.2 R3.1 U1.4(VSENSE)
$1N13388: D4.2 U10.2
$2N539: C12.2 U3.1(BOOT)
$2N541: C12.1 D2.1(C) L2.1 U3.8(PH)
$2N544: C13.2 R4.1 R5.2 U3.4(VSENSE)
$2N4985: H1.1 H2.2
$3N2179: C19.2 C20.2 C21.2 D3.1(K) U6.1(VM)
$3N2180: C21.1 U6.2(VCP)
$3N2198: C22.2 U6.3(CPH)
$3N2201: C22.1 U6.4(CPL)
$3N2328: C23.2 U6.6(VREF) U6.7(AVDD) U6.12(IDRIVE)
$3N2646: Q1.4(G) U6.24(GH2)
$3N2719: Q3.4(G) U6.22(GL2)
$3N2819: Q4.4(G) U6.19(GL1)
$3N2902: Q2.4(G) U6.17(GH1)
$3N3807: C26.2 R23.2 SW6.2 U7.2(VOUT)
$3N3882: NSLEEP1.1(+) R22.1
Net-(CN5-1): CN5.1 SW5.1 U9.2(+)
Net-(LED2-1): LED2.1(+) R23.1

Not connected (* = marked no-connect by the designer): SW6 1*; U1 2(NC)* 3(NC)* 5(ENA)*; U3 2(NC)* 3(NC)* 5(ENA)*; U5 8(3Y)* 9(3A)* 10(3OE#)* 11(4Y)* 12(4A)* 13(4OE#)*; U6 9(nFAULT)* 10(SNSOUT)* 11(SO)*

## Notes on the sheets
sheet 1
- 12V输入
- 12V—>5V
- 新EdgeBoard供电

# Board PCB1
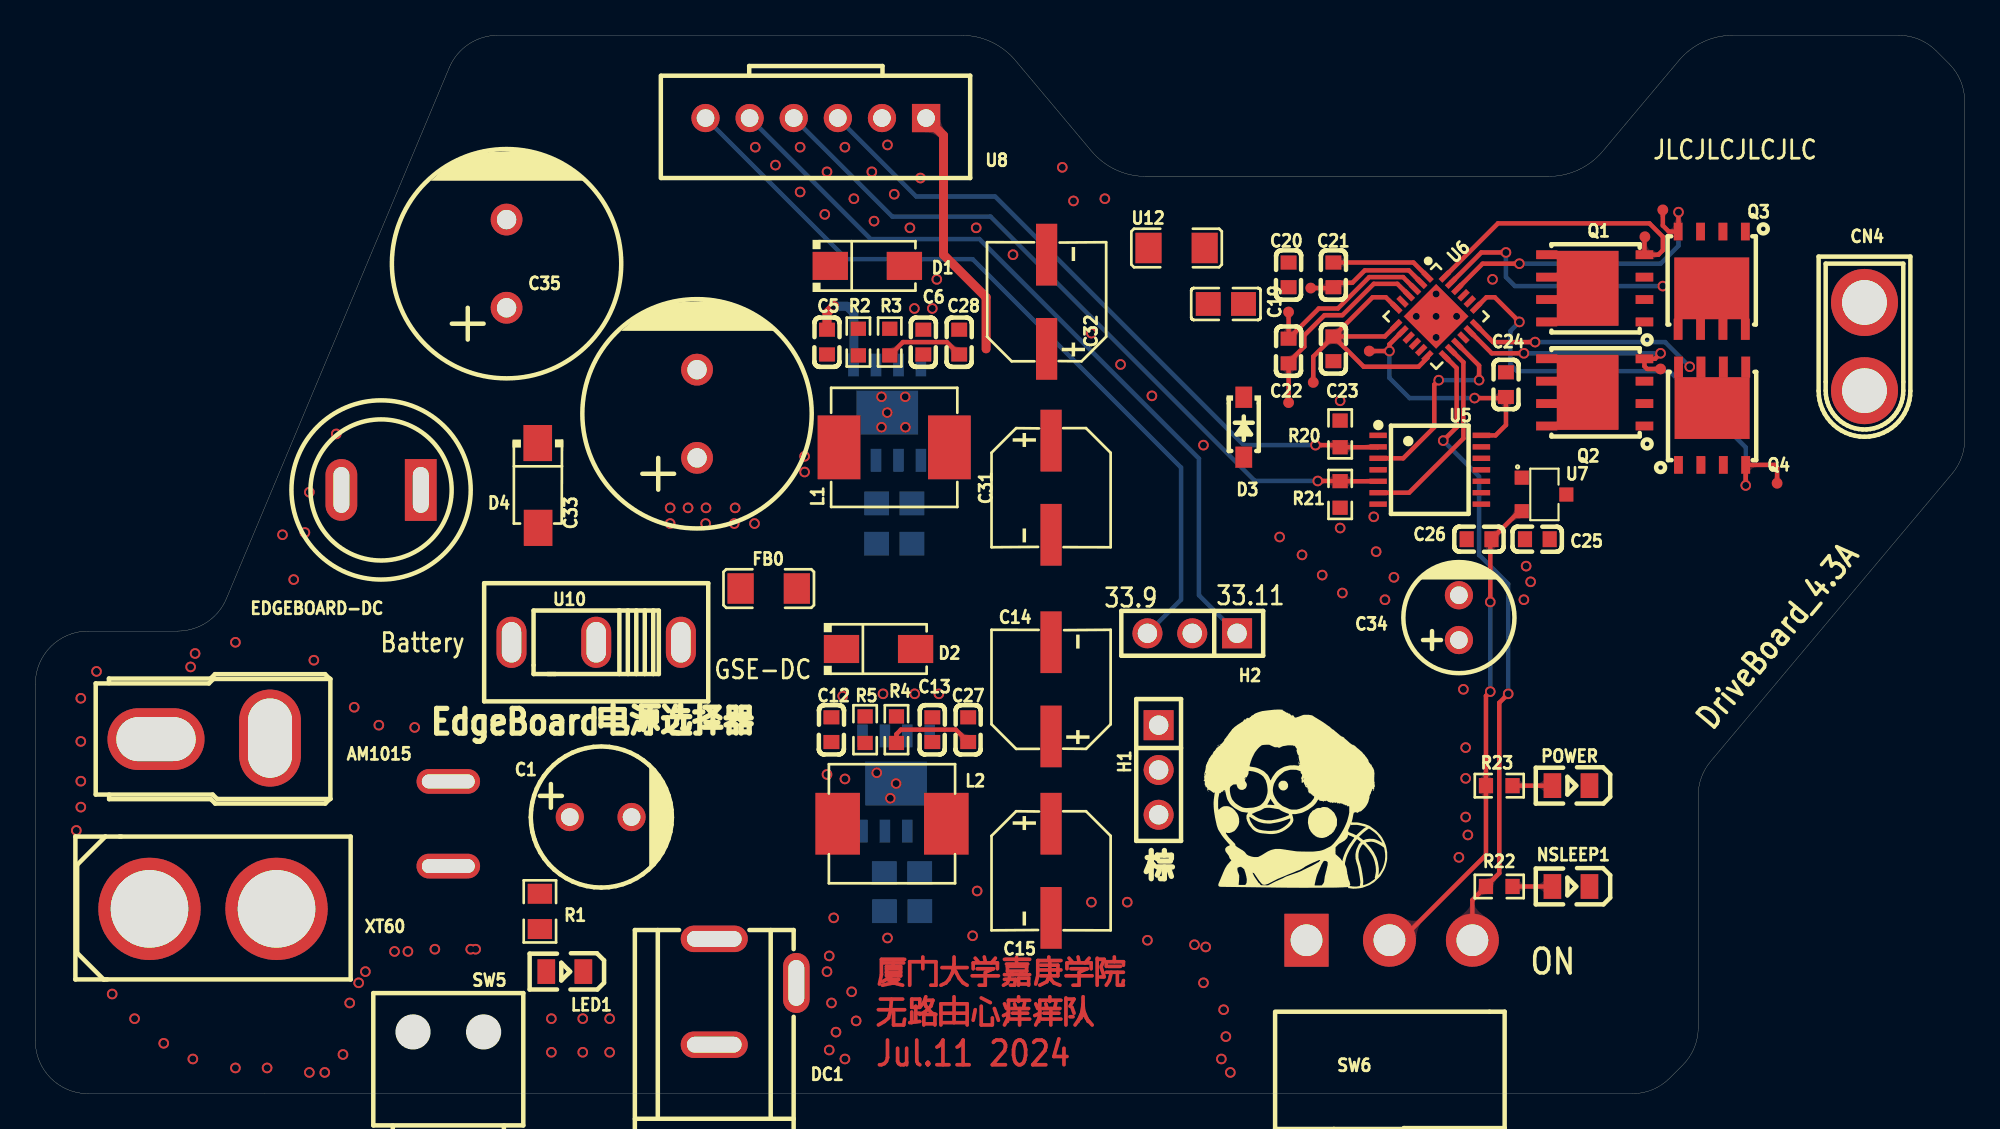
[diagram p3: board, top side]
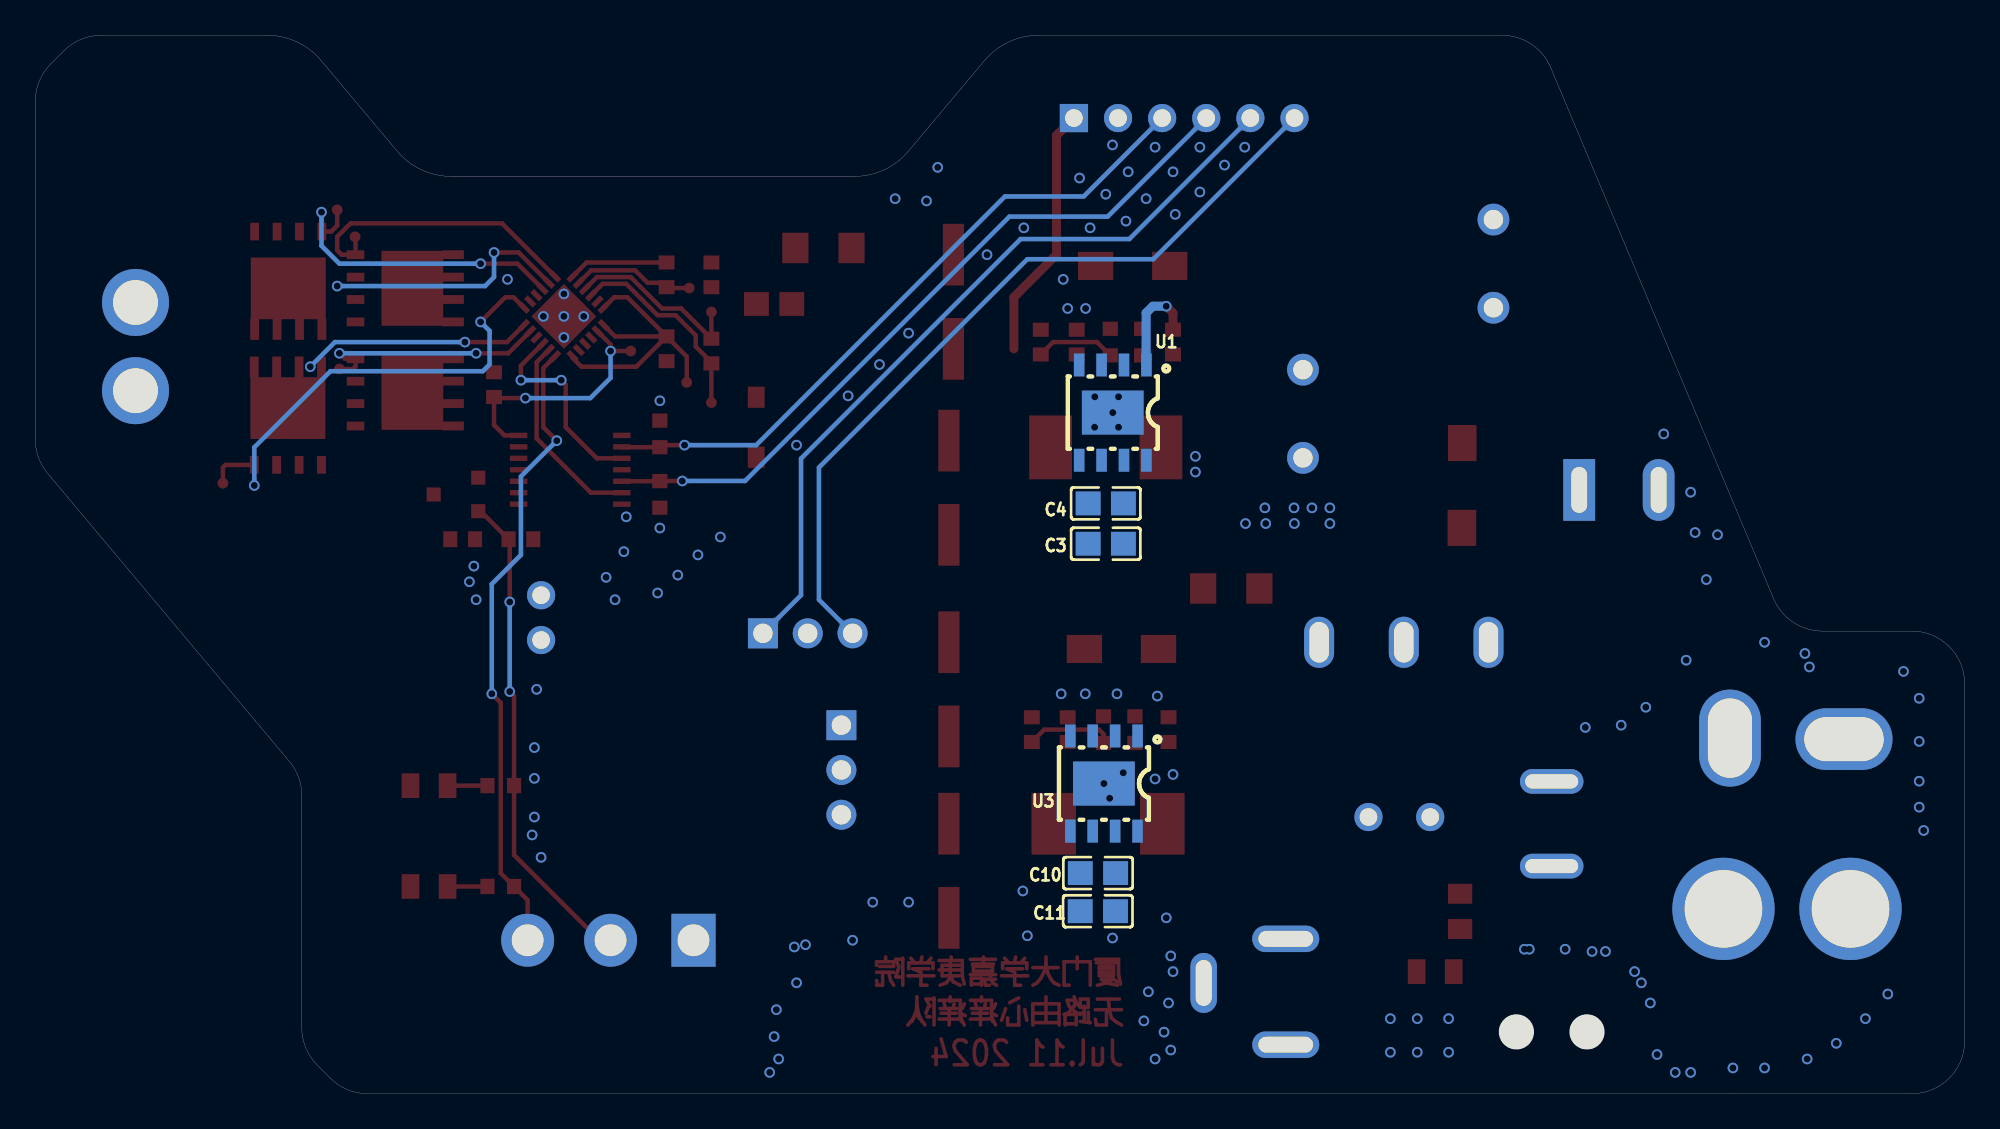
[diagram p4: board, bottom side, seen from below]

Outline 109.35 x 60 mm; copper layers: Top Layer, Bottom Layer. Coordinates in mm from the lower left corner of the outline.
Outline path: 0,23.23 arc(0.88,25.35) 3,26.23 8.07,26.23 arc(9.73,26.73) 10.83,28.07 23.47,58.18 arc(24.57,59.51) 26.23,60 52.49,60 arc(54.18,59.63) 55.55,58.57 59.87,53.43 arc(61.24,52.38) 62.93,52 85.77,52 arc(87.46,52.38) 88.84,53.43 93.15,58.57 arc(94.53,59.63) 96.22,60 105.61,60 arc(106.76,59.77) 107.73,59.12 108.47,58.38 arc(109.12,57.41) 109.35,56.26 109.35,37.09 arc(109.17,36.07) 108.65,35.16 94.95,18.84 arc(94.43,17.94) 94.25,16.91 94.25,3.74 arc(94.02,2.6) 93.37,1.62 92.63,0.88 arc(91.65,0.23) 90.51,0 12.99,0 3,0 arc(0.88,0.88) 0,3 0,23.23
Stack: Top Layer 0.035mm / Dielectric1 1.51mm FR4 er 4.5 / Bottom Layer 0.035mm

## Design rules (mm)
template: copperRegion
spacing copperThickness1oz (default): track to track 0.102, other pairs 0.127 to 0.3
spacing copperThickness2oz: track to track 0.203, other pairs 0.152 to 0.3
track width copperThickness1oz (default): min 0.127, default 0.254, max 2.54
track width copperThickness2oz: min 0.203, default 0.254, max 2.54
differential pair differentialPair (default): width min 0.127, default 0.254, max 2.54; gap min 0.152, default 0.152
via viaSize (default): diameter min 0.5, default 0.61, max 10; hole min 0.3, default 0.305, max 6.299

## Placement (name value [footprint] x y rotation side)
AM1015  AM-1015B-M  [CONN-TH_AM-1015B-M]  10.07 20.13 180 top
C1  470uF  [CAP-TH_BD8.0-P3.50-D0.6-FD]  32.04 15.69 0 top
C3  10uF  [C0805]  48.68 31.18 180 bottom
C4  10uF  [C0805]  48.68 33.47 180 bottom
C5  100nF  [C0603]  44.87 42.61 90 top
C6  470pF  [C0603]  50.33 42.61 90 top
C10  10uF  [C0805]  49.12 12.51 180 bottom
C11  10uF  [C0805]  49.13 10.35 180 bottom
C12  100nF  [C0603]  45.13 20.64 90 top
C13  470pF  [C0603]  50.84 20.64 90 top
C14  220uF  [CAP-SMD_BD6.3-L6.6-W6.6-FD]  57.57 22.92 90 top
C15  220uF  [CAP-SMD_BD6.3-L6.6-W6.6-FD]  57.57 12.64 270 top
C19  10uF  [C0805]  67.48 44.77 0 top
C20  100nF  [C0603]  71.03 46.42 90 top
C21  1uF  [C0603]  73.57 46.42 90 top
C22  100nF  [C0603]  71.03 42.1 90 top
C23  1uF  [C0603]  73.57 42.23 90 top
C24  1uF  [C0603]  83.35 40.2 270 top
C25  1uF  [C0603]  85.13 31.43 0 top
C26  1uF  [C0603]  81.83 31.43 0 top
C27  100nF  [C0603]  52.87 20.64 90 top
C28  100nF  [C0603]  52.36 42.61 90 top
C31  100uF  [CAP-SMD_BD6.3-L6.6-W6.6-LS7.2-FD]  57.57 34.35 270 top
C32  100uF  [CAP-SMD_BD6.3-L6.6-W6.6-LS7.2-FD]  57.32 44.9 90 top
C33  1000uF  [CAP-TH_BD13.0-P5.00-D0.6-FD]  37.51 38.55 90 top
C34  100uF  [CAP-TH_BD6.3-P2.50-D1.0-FD]  80.68 26.99 90 top
C35  1000uF  [CAP-TH_BD13.0-P5.00-D0.6-FD]  26.71 47.05 90 top
CN4  XT30U-M  [CONN-TH_XT30U-M]  103.67 42.36 270 top
D1  SS34  [SMA_L4.3-W2.5-LS5.0-RD]  47.16 46.93 0 top
D2  SS34  [SMA_L4.3-W2.5-LS5.0-RD]  47.79 25.21 0 top
D3  1N5819HW  [SOD-123_L2.7-W1.6-LS3.7-RD-1]  68.49 37.78 270 top
D4  SS54  [SMA_L4.3-W2.6-LS5.0-RD]  28.49 34.48 270 top
DC1  DC-005-A200  [DC-IN-TH_DC-005-A200]  40.81 5.78 90 top
EDGEBOARD-DC  DC-022B-2.0  [DC-IN-TH_DC-022B-2.0]  19.6 34.23 0 top
FB0  YI321611Z121-6R0T  [L1206]  41.57 28.64 0 top
H1  PZ254V-11-03P  [HDR-TH_3P-P2.54-V-M]  63.67 18.35 270 top
H2  PZ254V-11-03P  [HDR-TH_3P-P2.54-V-M]  65.57 26.1 180 top
L1  15uH  [IND-SMD_L7.0-W6.6_FXL0630]  48.68 36.64 180 top
L2  10uH  [IND-SMD_L7.0-W6.6_FXL0650]  48.55 15.3 180 top
LED1  NCD0805R1  [LED0805-R-RD]  30.01 6.92 180 top
NOREF  -  [Pad_e4604]  75.61 42.1 0 top
NOREF#2  -  [Pad_e4515]  71.03 44.31 0 top
NOREF#3  -  [Pad_e4517]  91.23 48.58 0 top
NOREF#4  -  [Pad_e4516]  71.03 39.18 0 top
NOREF#5  -  [Pad_e4519]  98.72 34.61 0 top
NOREF#6  -  [Pad_e4518]  92.24 50.1 0 top
NOREF#7  -  [Pad_e4555]  72.29 45.67 0 top
NOREF#8  -  [Pad_e4514]  72.43 40.32 0 top
NOREF#9  -  [Pad_e4520]  92.11 41.09 0 top
NSLEEP1  NCD0805R1  [LED0805-R-RD]  87.04 11.75 180 top
POWER  NCD0805R1  [LED0805-R-RD]  87.04 17.46 180 top
Q1  TPH1R403NL  [DSOP-8_L5.0-W5.0-P1.27-LS6.0-BL-EP]  88.43 45.66 90 top
Q2  TPH1R403NL  [DSOP-8_L5.0-W5.0-P1.27-LS6.0-BL-EP]  88.43 39.76 90 top
Q3  TPH1R403NL  [DSOP-8_L5.0-W5.0-P1.27-LS6.0-BL-EP]  95.01 46.1 180 top
Q4  TPH1R403NL  [DSOP-8_L5.0-W5.0-P1.27-LS6.0-BL-EP]  95.04 38.42 0 top
R1  10kΩ  [R0805]  28.6 10.34 90 top
R2  3.24kΩ  [R0603]  46.65 42.61 90 top
R3  10kΩ  [R0603]  48.43 42.61 270 top
R4  10kΩ  [R0603]  48.81 20.64 270 top
R5  2.2kΩ  [R0603]  47.03 20.64 90 top
R20  10kΩ  [R0603]  73.95 37.4 90 top
R21  10kΩ  [R0603]  73.95 33.97 270 top
R22  2.2kΩ  [R0603]  82.97 11.75 180 top
R23  2.2kΩ  [R0603]  82.97 17.46 180 top
SW5  KCD11-BL  [SW-TH_KCD11-BL]  23.41 15.3 0 top
SW6  SS-12D06L5  [SW-TH_3P-P4.70_L11.1-W12.7]  76.75 8.7 0 top
U1  TPS5430DDAR  [ESOP-8_L4.9-W3.9-P1.27-LS6.0-TL-EP]  48.28 38.61 270 bottom
U3  TPS5430DDAR  [ESOP-8_L4.9-W3.9-P1.27-LS6.0-TL-EP]  48.79 17.58 270 bottom
U5  SN74HC125PWR  [TSSOP-14_L5.0-W4.4-P0.65-LS6.5-BL]  79.03 35.37 270 top
U6  DRV8701ERGER  [VQFN-24_L4.0-W4.0-P0.50-BL-EP2.5]  79.39 44.07 225 top
U7  LR8341A-T33  [SOT-23-3L_L2.9-W1.6-P1.90-LS2.8-BL]  85.51 33.97 270 top
U8  ZX-HA2.54-6PZZ  [CONN-TH_6P-P2.50_ZX-HA2.54-6PZZ]  44.24 55.31 180 top
U10  SS12D10G5  [SW-TH_SHOU-HAN_SS12D10G4]  31.79 25.59 180 top
U12  YI321611Z121-6R0T  [L1206]  64.68 47.94 0 top
XT60  XT60  [CONN-TH_XT60]  10.07 10.48 0 top

## Footprints (pads in the part's own frame, mm; a bottom-side part is the same pattern mirrored in y, then rotated)
C0603
  rect 0.8x0.9 smd: 1(-0.7,0) 2(0.7,0)
C0805
  rect 1.41x1.35 smd: 1(-1,0) 2(1,0)
CAP-SMD_BD6.3-L6.6-W6.6-FD
  rect 3.5x1.2 smd: 1(-2.67,0) 2(2.67,0)
CAP-SMD_BD6.3-L6.6-W6.6-LS7.2-FD
  rect 3.5x1.2 smd: 1(-2.67,0) 2(2.67,0)
CAP-TH_BD6.3-P2.50-D1.0-FD
  round 1.6 hole 1: 1(-1.27,0) 2(1.27,0)
CAP-TH_BD8.0-P3.50-D0.6-FD
  round 1.6 hole 1: 1(-1.75,0) 2(1.75,0)
CAP-TH_BD13.0-P5.00-D0.6-FD
  round 1.8 hole 1.1: 1(-2.5,0) 2(2.5,0)
CONN-TH_6P-P2.50_ZX-HA2.54-6PZZ
  rect 1.6x1.6 hole 1: 1(-6.25,0)
  round 1.6 hole 1: 2(-3.75,0) 3(-1.25,0) 4(1.25,0) 5(3.75,0) 6(6.25,0)
CONN-TH_AM-1015B-M
  oval 3.5x5.5 hole 2.5x4.5: 1(-3.231,-0.029)
  oval 5.5x3.5 hole 4.5x2.5: 2(3.231,0.029)
CONN-TH_XT30U-M
  round 3.8 hole 2.54: 1(-2.5,0) 2(2.5,0)
CONN-TH_XT60
  round 5.8 hole 4.4: 1(-3.6,0) 2(3.6,0)
DC-IN-TH_DC-005-A200
  oval 1.5x3.8 hole 0.9x3.1: 1(2.999,2.325) 2(-3,2.325)
  oval 3.4x1.5 hole 2.6x0.9: 3(0.5,-2.325)
DC-IN-TH_DC-022B-2.0
  rect 1.8x3.5 hole 0.9x2.6: 1(2.25,0)
  oval 1.8x3.5 hole 0.9x2.6: 3(-2.25,0)
DSOP-8_L5.0-W5.0-P1.27-LS6.0-BL-EP
  rect 0.5x1 smd: 1(-1.905,-2.77) 2(-0.635,-2.77) 3(0.634,-2.77) 4(1.905,-2.77)
  rect 0.5x1.2 smd: 5(1.905,2.77) 6(0.635,2.77) 7(-0.634,2.77) 8(-1.905,2.77)
  custom 4.25x3.5 smd: 9(0,0.45)
ESOP-8_L4.9-W3.9-P1.27-LS6.0-TL-EP
  rect 1.3x0.6 smd: 1(-2.7,1.905) 2(-2.7,0.635) 3(-2.7,-0.635) 4(-2.7,-1.905) 5(2.7,-1.905) 6(2.7,-0.635) 7(2.7,0.635) 8(2.7,1.905)
  rect 2.5x3.5 smd: 9(0,0)
HDR-TH_3P-P2.54-V-M
  rect 1.7x1.7 hole 1.1: 1(-2.54,0)
  round 1.7 hole 1.1: 2(0,0) 3(2.54,0)
IND-SMD_L7.0-W6.6_FXL0630
  rect 2.424x3.62 smd: 1(3.128,0) 2(-3.128,0)
IND-SMD_L7.0-W6.6_FXL0650
  rect 2.524x3.5 smd: 1(3.078,0) 2(-3.078,0)
L1206
  rect 1.485x1.728 smd: 1(-1.593,0) 2(1.593,0)
LED0805-R-RD
  rect 1x1.399 smd: 1(1.05,0) 2(-1.05,0)
Pad_e4514
  round 0.61 smd: TP1(0,0)
Pad_e4515
  round 0.61 smd: TP2(0,0)
Pad_e4516
  round 0.61 smd: TP3(0,0)
Pad_e4517
  round 0.61 smd: TP4(0,0)
Pad_e4518
  round 0.61 smd: TP5(0,0)
Pad_e4519
  round 0.61 smd: TP6(0,0)
Pad_e4520
  round 0.61 smd: TP7(0,0)
Pad_e4555
  round 0.61 smd: TP9(0,0)
Pad_e4604
  round 0.61 smd: TP11(0,0)
R0603
  rect 0.806x0.864 smd: 1(-0.753,0) 2(0.753,0)
R0805
  rect 1.133x1.377 smd: 1(-1,0) 2(1,0)
SMA_L4.3-W2.5-LS5.0-RD
  rect 2x1.593 smd: 1(-2.1,0) 2(2.1,0)
SMA_L4.3-W2.6-LS5.0-RD
  rect 2.046x1.62 smd: 1(-2.404,-0.009) 2(2.404,0.009)
SOD-123_L2.7-W1.6-LS3.7-RD-1
  rect 1.2x0.95 smd: 1(-1.7,0) 2(1.7,0)
SOT-23-3L_L2.9-W1.6-P1.90-LS2.8-BL
  rect 0.8x0.8 smd: 1(-0.95,-1.265) 2(0.95,-1.265) 3(0.005,1.265)
SW-TH_3P-P4.70_L11.1-W12.7
  rect 2.5x3 hole 1.8: 1(-4.7,0)
  round 3 hole 1.8: 2(0,0) 3(4.7,0)
SW-TH_KCD11-BL
  oval 3.6x1.4 hole 3x0.8: 1(0,2.4) 2(0,-2.4)
SW-TH_SHOU-HAN_SS12D10G4
  oval 1.7x2.9 hole 1.1x2.3: 1(-4.8,0) 2(0,0) 3(4.8,0)
TSSOP-14_L5.0-W4.4-P0.65-LS6.5-BL
  rect 0.305x0.991 smd: 1(-1.95,-2.925) 2(-1.3,-2.925) 3(-0.65,-2.925) 4(0,-2.925) 5(0.65,-2.925) 6(1.3,-2.925) 7(1.95,-2.925) 8(1.95,2.925) 9(1.3,2.925) 10(0.65,2.925) 11(0,2.925) 12(-0.65,2.925) 13(-1.3,2.925) 14(-1.95,2.925)
VQFN-24_L4.0-W4.0-P0.50-BL-EP2.5
  rect 0.3x0.7 smd: 1(-1.25,-1.942) 2(-0.75,-1.942) 3(-0.25,-1.942) 4(0.25,-1.942) 5(0.75,-1.942) 6(1.25,-1.942) 13(1.25,1.942) 14(0.75,1.942) 15(0.25,1.942) 16(-0.25,1.942) 17(-0.75,1.942) 18(-1.25,1.942)
  rect 0.7x0.3 smd: 7(1.948,-1.25) 8(1.948,-0.75) 9(1.948,-0.25) 10(1.948,0.25) 11(1.948,0.75) 12(1.948,1.25) 19(-1.948,1.25) 20(-1.948,0.75) 21(-1.948,0.25) 22(-1.948,-0.25) 23(-1.948,-0.75) 24(-1.948,-1.25)
  rect 2.6x2.6 smd: 25(0.001,-0.001)

## Nets
+5V: C28.1 C31.1 C32.1 L1.2 R3.2 U8.1
DVDD: C24.2 NOREF.TP11 U5.14 U6.8
GND: C3.1 C4.1 C6.1 C10.1 C11.1 C13.1 C14.2 C15.2 C27.2 C28.2 C31.2 C32.2 D1.2 D2.2 FB0.2 H1.3 R2.1 R5.1 U1.6 U1.9 U3.6 U3.9 U8.2 U12.1
GND_DRV: C19.1 C20.1 C23.1 C24.1 C25.1 C26.1 C34.2 NSLEEP1.2 POWER.2 Q3.1 Q3.2 Q3.3 Q4.1 Q4.2 Q4.3 R20.2 R21.2 U5.1 U5.4 U5.7 U6.5 U6.16 U6.20 U6.21 U6.25 U7.1 U12.2
PGND: AM1015.2 C1.2 C33.2 C35.2 DC1.2 DC1.3 EDGEBOARD-DC.3 FB0.1 LED1.2 XT60.1
VCC-12V-GSE: DC1.1 U10.1
VCC_12V: C1.1 C3.2 C4.2 C10.2 C11.2 C25.2 C34.1 D3.2 Q1.5 Q1.6 Q1.7 Q1.8 Q1.9 Q2.5 Q2.6 Q2.7 Q2.8 Q2.9 R1.2 SW5.2 U1.7 U3.7 U7.3 U10.3
VCC_12V-1: C33.1 C35.1 D4.1 EDGEBOARD-DC.1
EN: U5.6 U6.14
MCU_MOTOR_DIR: R20.1 U5.2 U8.3
MCU_MOTOR_PWM: R21.1 U5.5 U8.4
MCU_SERVO_PWM_A: H2.1 U8.5
MCU_SERVO_PWM_B: H2.3 U8.6
MOTOR-A: CN4.1 Q1.1 Q1.2 Q1.3 Q3.5 Q3.6 Q3.7 Q3.8 Q3.9 U6.23
MOTOR-B: CN4.2 Q2.1 Q2.2 Q2.3 Q4.5 Q4.6 Q4.7 Q4.8 Q4.9 U6.18
NSLEEP: R22.2 SW6.3 U6.13
PH: U5.3 U6.15
SERVO_6V35: C14.1 C15.1 C27.1 H1.2 L2.2 R4.2
$1N587: LED1.1 R1.1
$1N979: C5.2 U1.1
$1N1371: C5.1 D1.1 L1.1 U1.8
$1N1705: C6.2 R2.2 R3.1 U1.4
$1N13388: D4.2 U10.2
$1N14960: AM1015.1 SW5.1 XT60.2
$2N539: C12.2 U3.1
$2N541: C12.1 D2.1 L2.1 U3.8
$2N544: C13.2 R4.1 R5.2 U3.4
$2N4985: H1.1 H2.2
$3N2179: C19.2 C20.2 C21.2 D3.1 U6.1
$3N2180: C21.1 NOREF#7.TP9 U6.2
$3N2198: C22.2 NOREF#2.TP2 U6.3
$3N2201: C22.1 NOREF#4.TP3 U6.4
$3N2328: C23.2 NOREF#8.TP1 U6.6 U6.7 U6.12
$3N2646: NOREF#3.TP4 Q1.4 U6.24
$3N2719: NOREF#6.TP5 Q3.4 U6.22
$3N2819: NOREF#5.TP6 Q4.4 U6.19
$3N2902: NOREF#9.TP7 Q2.4 U6.17
$3N3807: C26.2 R23.2 SW6.2 U7.2
$3N3882: NSLEEP1.1 R22.1
$3N10147: POWER.1 R23.1

Pads without a net: SW6 1; U1 2 3 5; U3 2 3 5; U5 8 9 10 11 12 13; U6 9 10 11

## Via types
v1: diameter 0.6, hole 0.4, Top Layer to Bottom Layer, 159 vias

## Routing (per net, layer and track width the routed paths; a pad name or vN(x,y) marks a point on that pad's centre or on a via; arc(x,y) is an arc through that point)
+5V: length 19
  Top Layer w0.254: C28.1 51.66,42.61 49.18,42.61 R3.2
  Top Layer w0.508: U8.1 51.48,54.32 51.48,47.56 53.89,45.15 53.89,42.23
DVDD: length 14.4
  Top Layer w0.254: v1(81.57,39.43) 83.29,39.43 C24.2 83.35,37.91 82.76,37.32 U5.14 ; NOREF.TP11 v1(76.75,42.1) 76.75,42.48 77.49,43.22
  Bottom Layer w0.254: v1(81.57,39.43) 77.89,39.43 76.75,40.58 v1(76.75,42.1)
GND:
  vias: v1(40.81,53.66) v1(41.95,52.64) v1(43.35,53.66) v1(43.35,51.12) v1(44.74,49.85) v1(44.87,52.26) v1(44.87,6.92) v1(45,7.81) v1(45,2.48) v1(45.13,5.14) v1(45.25,9.97) v1(45.38,3.49) v1(45.89,53.66) v1(45.89,1.97) v1(46.27,5.78) v1(46.39,50.74) v1(46.52,4.13) v1(47.41,52.26) v1(47.54,49.47) v1(47.69,18.19) v1(47.96,39.51) v1(47.96,37.78) v1(48.3,53.79) v1(48.28,38.61) v1(48.3,8.83) v1(48.46,16.75) v1(48.68,50.99) v1(48.79,17.58) v1(49.3,39.51) v1(49.32,37.78) v1(49.57,49.09) v1(50.17,51.91) v1(51.09,46.17) v1(53.13,8.95) v1(53.33,49.09) v1(53.38,11.49) v1(55.41,47.56) v1(58.21,52.52) v1(58.84,50.61) v1(59.86,43.12) v1(59.86,10.86) v1(60.62,50.74) v1(61.51,41.34) v1(61.89,10.86) v1(63.03,8.7) v1(63.29,39.56) v1(65.7,8.45) v1(66.21,6.29) v1(66.33,8.32) v1(67.22,1.97) v1(67.35,4.76) v1(67.48,3.24) v1(67.73,1.21)
GND_DRV:
  vias: v1(66.21,36.77) v1(70.52,31.56) v1(71.8,30.54) v1(72.94,29.4) v1(73.95,39.28) v1(73.95,32.07) v1(74.08,28.39) v1(75.86,32.7) v1(75.99,30.73) v1(76.49,28) v1(77,29.27) v1(78.27,44.07) v1(79.39,45.34) v1(79.39,44.07) v1(79.39,42.87) v1(80.55,44.07) v1(80.68,13.4) v1(80.94,22.92) v1(81.07,19.62) v1(81.07,17.88) v1(81.07,15.69) v1(81.19,14.67) v1(82.59,46.17) v1(84.37,28) v1(84.49,29.91) v1(84.75,29.02)
PGND:
  vias: v1(2.33,14.92) v1(2.58,22.42) v1(2.58,19.97) v1(2.58,17.72) v1(2.58,16.25) v1(3.47,23.94) v1(4.36,5.65) v1(5.63,4.26) v1(7.28,2.86) v1(8.8,24.19) v1(8.93,1.97) v1(9.06,24.96) v1(11.34,25.59) v1(11.34,1.46) v1(13.14,1.46) v1(14.01,31.69) v1(14.64,29.15) v1(15.28,31.81) v1(15.53,34.1) v1(15.53,1.21) v1(15.79,24.58) v1(16.41,1.21) v1(17.06,37.4) v1(17.44,2.22) v1(17.82,5.14) v1(18.07,21.91) v1(18.33,6.29) v1(18.71,6.92) v1(19.47,20.89) v1(20.36,8.06) v1(21.12,8.06) v1(21.5,20.77) v1(22.65,8.19) v1(24.68,8.19) v1(24.96,8.19) v1(29.25,4.26) v1(29.25,2.35) v1(31.03,4.26) v1(31.03,2.35) v1(32.55,4.26) v1(32.55,2.35) v1(35.98,33.21) v1(35.98,32.32) v1(37,33.21) v1(38.01,33.21) v1(37.99,32.32) v1(39.61,32.32) v1(39.66,33.21) v1(40.76,32.32)
EN: length 11.4
  Top Layer w0.254: 76.11,34.07 77.86,34.07 80.94,37.15 80.94,41.47 80.24,42.16 U6.14
MCU_MOTOR_DIR: length 38.4
  Top Layer w0.254: v1(72.56,36.77) 73.84,36.77 R20.1 76.09,36.65 U5.2
  Bottom Layer w0.254: v1(72.56,36.77) 68.49,36.77 54.4,50.86 49.93,50.86 U8.3
MCU_MOTOR_PWM: length 41.7
  Top Layer w0.254: v1(72.68,34.74) 73.95,34.74 R21.1 73.96,34.72 U5.5
  Bottom Layer w0.254: v1(72.68,34.74) 69.13,34.74 54.14,49.72 48.57,49.72 U8.4
MCU_SERVO_PWM_A: length 44.3
  Bottom Layer w0.254: 68.11,26.1 65.95,28.26 65.95,36.01 53.51,48.45 47.34,48.45 U8.5
MCU_SERVO_PWM_B: length 45.3
  Bottom Layer w0.254: H2.3 64.94,28 64.94,35.5 53.13,47.31 45.99,47.31 U8.6
MOTOR-A: length 14.3
  Top Layer w0.254: U6.23 81.96,47.69 v1(83.35,47.69)
  Bottom Layer w0.254: v1(92.24,45.78) 83.86,45.78 83.35,46.29 v1(83.35,47.69)
MOTOR-B: length 13.1
  Top Layer w0.254: U6.18 82.62,42.61 v1(85,42.61)
  Bottom Layer w0.254: v1(85,42.61) 92.37,42.61 v1(93.77,41.21)
NSLEEP: length 36.1
  Top Layer w0.254: v1(79.8,37.02) 80.56,37.78 80.56,41.13 U6.13 ; v1(83.48,22.67) 82.97,22.16 82.97,12.5 R22.2 81.45,10.98 SW6.3
  Bottom Layer w0.254: v1(79.8,37.02) 81.83,34.99 81.83,30.54 83.48,28.89 v1(83.48,22.67)
PH: length 11.5
  Top Layer w0.254: 80.59,42.52 81.83,41.28 v1(81.83,40.45) ; U5.3 77.52,36.02 79.29,37.78 79.29,40.2 v1(79.54,40.45)
  Bottom Layer w0.254: v1(79.54,40.45) v1(81.83,40.45)
SERVO_6V35: length 5
  Top Layer w0.254: R4.2 48.81,20.38 49.06,20.64 52.17,20.64 C27.1
$1N979: length 5.7
  Top Layer w0.508: C5.2 44.87,44.26 v1(45.25,44.64)
  Bottom Layer w0.508: U1.1 46.39,41.33 46.39,44.26 46.01,44.64 v1(45.25,44.64)
$1N1371:
  vias: v1(43.6,36.13) v1(43.6,35.24)
$1N1705:
  vias: v1(49.82,44.51) v1(50.84,44.51)
$2N539:
  vias: v1(45.76,22.54)
$2N541:
  vias: v1(44.87,18.1) v1(45.89,17.84)
$2N544:
  vias: v1(48.05,22.67) v1(49.84,22.67) v1(51.21,22.67)
$3N2179: length 5.7
  Top Layer w0.254: C21.2 78.11,47.12 U6.1
$3N2180: length 7
  Top Layer w0.254: U6.2 77.85,46.67 75.35,46.67 74.65,45.97 73.82,45.97 C21.1 73.53,45.67 NOREF#7.TP9
$3N2198: length 10.4
  Top Layer w0.254: NOREF#2.TP2 71.03,44.31 C22.2 72.75,44.51 73.83,44.51 75.61,46.29 77.52,46.29 U6.3
$3N2201: length 11.6
  Top Layer w0.254: U6.4 77.2,45.91 75.86,45.91 74.08,44.13 73.07,44.13 71.92,42.99 71.92,42.36 71.03,41.47 C22.1 NOREF#4.TP3
$3N2328: length 18
  Top Layer w0.254: C23.2 72.43,41.78 NOREF#8.TP1 ; C23.2 75.29,41.21 78.4,41.21 78.9,41.71 U6.12 ; C23.2 76.49,42.93 77.13,43.57 ; C23.2 75.79,45.15 76.54,45.15 U6.6
$3N2646: length 16.9
  Top Layer w0.254: U6.24 82.9,49.34 91.48,49.34 92.24,48.58 92.24,47.82 91.99,47.56 Q1.4 91.2,48.55 NOREF#3.TP4
$3N2719: length 18.5
  Top Layer w0.254: NOREF#6.TP5 92.24,49.21 92.58,48.87 Q3.4 93.13,48.9 v1(93.13,49.98) ; v1(84.11,47.05) 82.03,47.05 80.59,45.62
  Bottom Layer w0.254: v1(84.11,47.05) 92.11,47.05 93.13,48.07 v1(93.13,49.98)
$3N2819: length 27.2
  Top Layer w0.254: U6.19 82.24,45.15 82.72,45.15 v1(84.11,43.75) ; NOREF#5.TP6 98.72,35.5 98.57,35.65 96.94,35.65 v1(96.94,34.48)
  Bottom Layer w0.254: v1(84.11,43.75) 83.61,43.24 83.61,41.34 83.99,40.96 92.62,40.96 96.94,36.64 v1(96.94,34.48)
$3N2902: length 13.8
  Top Layer w0.254: NOREF#9.TP7 91.35,41.09 91.2,41.24 91.2,41.66 91.8,41.66 v1(92.11,41.97) ; U6.17 82.55,41.97 v1(84.37,41.97)
  Bottom Layer w0.254: v1(92.11,41.97) v1(84.37,41.97)
$3N3807: length 27.9
  Top Layer w0.254: 84.25,33.02 84.12,33.02 82.46,31.37 v1(82.46,27.88) ; SW6.2 77.38,8.7 82.22,13.53 R23.2 82.22,22.55 v1(82.46,22.8)
  Bottom Layer w0.254: v1(82.46,27.88) v1(82.46,22.8)
$3N3882: length 2.3
  Top Layer w0.254: R22.1 NSLEEP1.1
$3N10147: length 2.3
  Top Layer w0.254: R23.1 POWER.1

## Copper pours and planes (outline as drawn; the poured copper is in the pictures)
+5V on Top Layer: 51.41,42.61 51.41,40.16 49.69,38.43 49.69,34.49 50.08,34.1 57.95,34.1 58.84,34.99 58.84,44.9 55.92,44.9 53.69,42.66 51.46,42.66
GND on Top Layer: 35.05,64.07 63.92,64.07 65.19,62.8 65.19,31.31 69.26,27.24 69.26,-2.48 68.62,-3.11 44.87,-3.11 44.11,-2.35 44.11,11.11 41.95,13.27 41.95,24.65 41.57,25.03 41.57,45.79 35.45,51.91 35.45,63.66
GND on Bottom Layer: 34.2,63.95 62.14,63.95 64.17,61.91 64.17,53.4 64.94,52.64 64.94,-3.24 47.54,-3.24 47.41,-3.36 44.24,-0.19 44.24,9.21 43.47,9.97 43.47,24.45 41.95,25.97 41.95,45.45 35.49,51.91 35.49,62.66
GND_DRV on Top Layer: 65.19,31.69 69.51,27.37 69.51,-3.24 103.55,-3.24 112.31,5.53 112.31,63.31 112.18,63.44 65.19,63.44
GND_DRV on Bottom Layer: 65.06,61.02 113.2,61.02 113.2,-2.73 65.06,-2.73
PGND on Top Layer: -2.25,-7.3 43.98,-7.3 43.98,62.55 -2.25,62.55
PGND on Bottom Layer: -0.98,60.64 34.96,60.64 35.35,60.26 35.35,51.63 41.82,45.15 41.82,24.83 39.03,22.04 39.03,13.88 43.63,9.28 43.63,-2.38 43.86,-2.6 -0.34,-2.6 -1.86,-4.13 -1.86,59.75
VCC-12V-GSE on Top Layer: 34.55,30.44 34.55,22.07 36.11,20.51 36.11,7.21 41.35,7.21 41.35,12.86 41.32,12.89 41.32,20.13 38.77,22.67 38.77,30.44
VCC_12V on Top Layer: 78.82,23.81 87.8,23.81 89.83,25.85 89.83,48.16 85.93,48.16 85.93,33.26 85.18,32.51 85.18,27.8 84.62,27.24 78.78,27.24 78.78,23.85
VCC_12V on Top Layer: 19.6,15.05 18.07,13.53 18.07,10.46 32.15,10.46 32.15,20.53 28.91,23.77 28.91,30.47 25.49,30.47 25.44,30.42 25.44,21.15 26.46,20.13 26.46,15.56 25.95,15.05
VCC_12V on Top Layer: 78.78,27.24 73.57,27.24 69.64,31.18 69.64,36.89 69.64,37.02 67.48,37.02 67.48,30.8 74.46,23.81 78.88,23.81 78.78,23.91
VCC_12V on Bottom Layer: 28.74,17.46 28.74,11.57 29.33,10.99 46.52,10.99 46.52,8.45 48.68,6.29 53.38,6.29 53.38,9.21 49.19,9.21 49.19,13.47 48.91,13.75 48.91,15.99 48.71,16.19 47.41,16.19 47.41,13.95 33.46,13.95 31.73,15.68 31.73,17.46
VCC_12V on Bottom Layer: 39.28,13.15 39.28,22.04 46.39,29.15 46.39,33.97 47.03,34.61 47.03,36.89 48.3,36.89 48.3,34.83 48.68,34.45 48.68,27.65 42.71,21.68 42.71,13.02 39.41,13.02
VCC_12V on Bottom Layer: 52.96,9.21 60.11,9.21 78.14,27.24 81.83,27.24 81.83,23.81 79.67,23.81 62.14,6.29 53.13,6.29 52.96,6.46
VCC_12V-1 on Top Layer: 19.6,32.07 23.92,32.07 26.08,34.23 39.42,34.23 39.42,36.63 29.12,46.93 29.12,47.05 26.71,47.05 19.6,39.94
VCC_12V-1 on Bottom Layer: 19.6,32.07 23.92,32.07 26.08,34.23 39.42,34.23 39.42,36.63 29.12,46.93 29.12,47.05 26.71,47.05 19.6,39.94
MOTOR-A on Top Layer: 90.46,46.93 91.86,46.93 92.88,47.94 97.7,47.94 98.7,46.95 107.12,46.95 107.23,47.05 107.23,42.48 91.1,42.48 90.21,43.37 90.21,46.67
MOTOR-B on Top Layer: 90.34,40.7 91.7,40.7 92.01,40.39 92.57,40.39 92.62,40.45 92.62,41.84 107.23,41.84 107.23,36.89 90.97,36.89 90.34,37.53
SERVO_6V35 on Top Layer: 51.89,20.63 51.89,19.02 49.44,17.78 49.44,12.38 59.22,12.38 59.22,22.92 56.68,22.92 54.4,20.64 51.9,20.64
SERVO_6V35 on Top Layer: 59.1,19.75 65.32,19.75 65.32,16.96 59.1,16.96
$1N587 on Top Layer: 27.2,10.46 30.13,10.46 30.13,5.53 27.2,5.53
$1N1371 on Top Layer: 47.58,33.47 42.77,33.47 42.77,48.13 43.22,48.58 46.39,48.58 46.83,48.14 46.83,45.6 46.9,45.53 46.52,45.15 44.36,45.15 43.86,44.64 43.86,42.62 45.71,42.62 45.71,40.38 47.54,38.55 47.54,33.51
$1N1371 on Bottom Layer: 42.99,36.64 46.91,36.64 46.91,34.7 42.97,34.7 42.97,36.61
$1N1705 on Top Layer: 46.01,42.89 51.54,42.89 51.54,45.02 46.01,45.02
$1N1705 on Bottom Layer: 49.32,44.9 51.25,44.9 51.25,40.03 49.32,40.03
$1N13388 on Top Layer: 26.96,30.54 26.96,33.72 32.3,33.72 33.95,32.07 32.42,30.54
$1N13388 on Top Layer: 29.63,24.19 33.95,24.19 33.95,32.07 29.63,32.07
$1N14960 on Top Layer: 9.95,6.56 9.95,24.07 13.76,24.07 17.95,19.88 25.69,19.88 25.69,15.5 18.91,15.5 17.44,14.03 17.44,6.92 17.07,6.56
$2N539 on Top Layer: 45,23.18 46.01,23.18 46.14,23.05 46.14,20.74 43.88,20.74 43.86,20.77 43.86,22.04
$2N539 on Bottom Layer: 45.89,19.13 44.42,21.21 44.42,22.18 45.41,23.18 46.01,23.18 47.69,21.5 47.69,19.13
$2N541 on Top Layer: 42.2,13.91 44.24,11.88 47.79,11.88 47.79,17.08 46.19,18.68 46.19,20.63 42.2,20.63
$2N541 on Top Layer: 42.2,20.51 42.2,24.7 44.24,26.73 47.29,26.73 47.29,23.81 45.38,23.81 43.6,22.04 43.6,20.51
$2N541 on Bottom Layer: 45.33,14.03 44.24,16.19 44.24,18.73 45.98,18.73 46.75,17.96 46.75,16.34 46.9,16.19 46.9,16.17 47.41,15.66 47.41,14.16 47.28,14.03
$2N544 on Top Layer: 46.27,20.64 46.27,20.64 46.27,23.18 51.73,23.18 51.86,23.05 51.86,20.91 51.58,20.64
$2N544 on Bottom Layer: 50.22,19.32 50.22,23.17 51.73,23.17 51.73,19.31 50.22,19.31
$2N544 on Bottom Layer: 50.35,22.17 47.55,22.17 47.54,22.16 47.54,23.18 50.44,23.18
$2N4985 on Top Layer: 64.25,27.62 64.25,25.28 62.14,23.18 62.14,19.82 65.23,19.82 65.23,23.38 66.97,25.12 66.97,27.62
$3N2179 on Top Layer: 74.28,46.41 70.39,46.41 69.76,45.78 69.76,38.55 67.48,38.55 67.48,46.67 68.62,47.82 74.21,47.82 74.33,47.69 74.33,46.46

Small or netless copper shapes (teardrops, artwork), in the pictures only: 91 on Top Layer, 27 on Bottom Layer

## Text on the board
Top Layer: 厦门大学嘉庚学院 / 无路由心痒痒队 / Jul.11 2024
Top Silkscreen Layer: Battery | GSE-DC | 33.9 | 33.11 | JLCJLCJLCJLC | DriveBoard_4.3A | ON | EdgeBoard电源选择器 | 棕
